# Altium project NODE_V2.PrjPcb
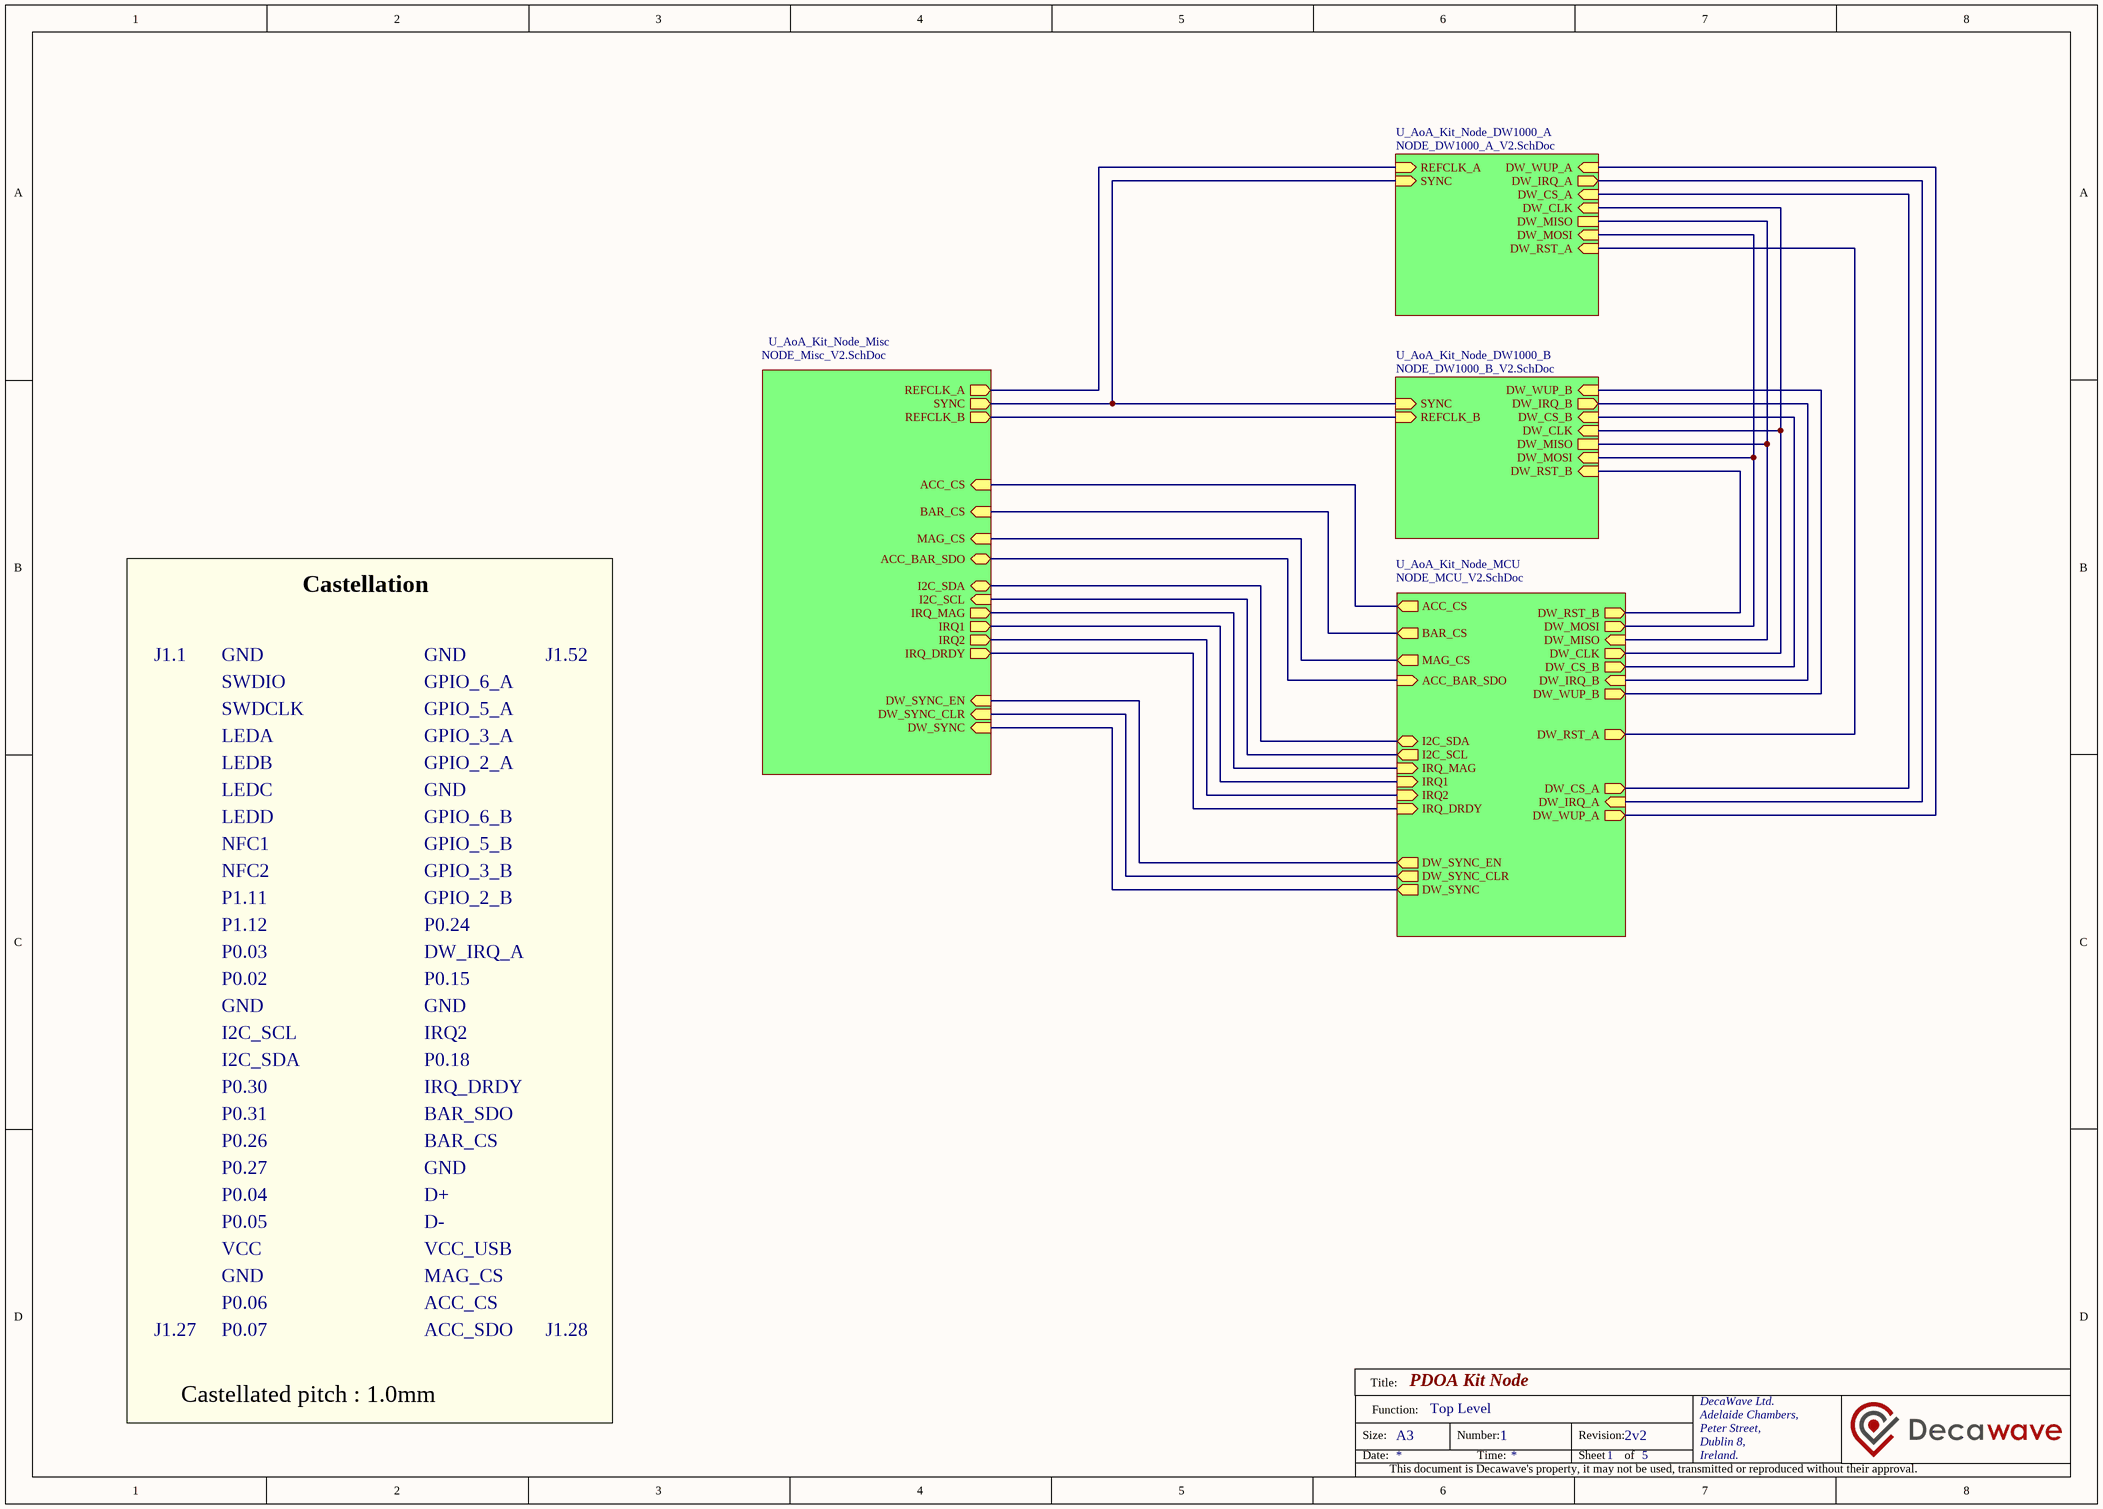
[diagram p0: NODE_Top_V2.SchDoc]
5 sheets, 231 parts. Net scope: hierarchical (ports join the sheet entries above them; power ports are global).
Board file: NODE_V2.PcbDoc
Sheets:
  NODE_Top_V2.SchDoc
    U_AoA_Kit_Node_Misc = NODE_Misc_V2.SchDoc
    U_AoA_Kit_Node_MCU = NODE_MCU_V2.SchDoc
    U_AoA_Kit_Node_DW1000_A = NODE_DW1000_A_V2.SchDoc
    U_AoA_Kit_Node_DW1000_B = NODE_DW1000_B_V2.SchDoc

## Sheet NODE_Top_V2.SchDoc: PDOA Kit Node
size A3; Organization: Decawave Ltd.; Address1: Adelaide Chambers,; Address2: Peter Street,; Address3: Dublin 8,; Address4: Ireland.; DocumentNumber: 1; Revision: 2v2; SheetNumber: 1; SheetTotal: 5; SheetFunction: Top Level; ProjectName: PDOA Kit Node

### Sub-sheets
U_AoA_Kit_Node_DW1000_A = NODE_DW1000_A_V2.SchDoc: DW_MOSI (in), DW_IRQ_A (out), DW_CS_A (in), DW_WUP_A (in), DW_MISO, DW_CLK (in), REFCLK_A (in), SYNC (in), DW_RST_A (in)
U_AoA_Kit_Node_DW1000_B = NODE_DW1000_B_V2.SchDoc: DW_MOSI (in), DW_IRQ_B (out), DW_CS_B (in), DW_WUP_B (in), DW_MISO, DW_CLK (in), REFCLK_B (in), SYNC (in), DW_RST_B (in)
U_AoA_Kit_Node_MCU = NODE_MCU_V2.SchDoc: DW_IRQ_A (in), DW_CS_A (out), DW_CS_B (out), DW_SYNC_EN (out), DW_SYNC_CLR (out), DW_SYNC (out), DW_MISO (in), DW_RST_A (out), DW_MOSI (out), DW_CLK (out), I2C_SDA (bidir), I2C_SCL (out), IRQ_MAG (in), IRQ1 (in), IRQ2 (in), IRQ_DRDY (in), DW_WUP_B (out), DW_IRQ_B (in), DW_RST_B (out), DW_WUP_A (out), ACC_CS (out), BAR_CS (out), MAG_CS (out), ACC_BAR_SDO (in)
U_AoA_Kit_Node_Misc = NODE_Misc_V2.SchDoc: REFCLK_B (out), REFCLK_A (out), SYNC (out), DW_SYNC_EN (in), DW_SYNC (in), DW_SYNC_CLR (in), I2C_SCL (in), I2C_SDA (bidir), IRQ_MAG (out), IRQ1 (out), IRQ2 (out), IRQ_DRDY (out), ACC_CS (in), BAR_CS (in), MAG_CS (in), ACC_BAR_SDO (bidir)

### Nets
ACC_BAR_SDO: sheet U_AoA_Kit_Node_Misc/ACC_BAR_SDO, sheet U_AoA_Kit_Node_MCU/ACC_BAR_SDO
ACC_CS: sheet U_AoA_Kit_Node_Misc/ACC_CS, sheet U_AoA_Kit_Node_MCU/ACC_CS
BAR_CS: sheet U_AoA_Kit_Node_Misc/BAR_CS, sheet U_AoA_Kit_Node_MCU/BAR_CS
DW_CLK: sheet U_AoA_Kit_Node_MCU/DW_CLK, sheet U_AoA_Kit_Node_DW1000_A/DW_CLK, sheet U_AoA_Kit_Node_DW1000_B/DW_CLK
DW_CS_A: sheet U_AoA_Kit_Node_MCU/DW_CS_A, sheet U_AoA_Kit_Node_DW1000_A/DW_CS_A
DW_CS_B: sheet U_AoA_Kit_Node_MCU/DW_CS_B, sheet U_AoA_Kit_Node_DW1000_B/DW_CS_B
DW_IRQ_A: sheet U_AoA_Kit_Node_MCU/DW_IRQ_A, sheet U_AoA_Kit_Node_DW1000_A/DW_IRQ_A
DW_IRQ_B: sheet U_AoA_Kit_Node_MCU/DW_IRQ_B, sheet U_AoA_Kit_Node_DW1000_B/DW_IRQ_B
DW_MISO: sheet U_AoA_Kit_Node_MCU/DW_MISO, sheet U_AoA_Kit_Node_DW1000_A/DW_MISO, sheet U_AoA_Kit_Node_DW1000_B/DW_MISO
DW_MOSI: sheet U_AoA_Kit_Node_MCU/DW_MOSI, sheet U_AoA_Kit_Node_DW1000_A/DW_MOSI, sheet U_AoA_Kit_Node_DW1000_B/DW_MOSI
DW_RST_A: sheet U_AoA_Kit_Node_MCU/DW_RST_A, sheet U_AoA_Kit_Node_DW1000_A/DW_RST_A
DW_RST_B: sheet U_AoA_Kit_Node_MCU/DW_RST_B, sheet U_AoA_Kit_Node_DW1000_B/DW_RST_B
DW_SYNC: sheet U_AoA_Kit_Node_Misc/DW_SYNC, sheet U_AoA_Kit_Node_MCU/DW_SYNC
DW_SYNC_CLR: sheet U_AoA_Kit_Node_Misc/DW_SYNC_CLR, sheet U_AoA_Kit_Node_MCU/DW_SYNC_CLR
DW_SYNC_EN: sheet U_AoA_Kit_Node_Misc/DW_SYNC_EN, sheet U_AoA_Kit_Node_MCU/DW_SYNC_EN
DW_WUP_A: sheet U_AoA_Kit_Node_MCU/DW_WUP_A, sheet U_AoA_Kit_Node_DW1000_A/DW_WUP_A
DW_WUP_B: sheet U_AoA_Kit_Node_MCU/DW_WUP_B, sheet U_AoA_Kit_Node_DW1000_B/DW_WUP_B
I2C_SCL: sheet U_AoA_Kit_Node_Misc/I2C_SCL, sheet U_AoA_Kit_Node_MCU/I2C_SCL
I2C_SDA: sheet U_AoA_Kit_Node_Misc/I2C_SDA, sheet U_AoA_Kit_Node_MCU/I2C_SDA
IRQ1: sheet U_AoA_Kit_Node_Misc/IRQ1, sheet U_AoA_Kit_Node_MCU/IRQ1
IRQ2: sheet U_AoA_Kit_Node_Misc/IRQ2, sheet U_AoA_Kit_Node_MCU/IRQ2
IRQ_DRDY: sheet U_AoA_Kit_Node_Misc/IRQ_DRDY, sheet U_AoA_Kit_Node_MCU/IRQ_DRDY
IRQ_MAG: sheet U_AoA_Kit_Node_Misc/IRQ_MAG, sheet U_AoA_Kit_Node_MCU/IRQ_MAG
MAG_CS: sheet U_AoA_Kit_Node_Misc/MAG_CS, sheet U_AoA_Kit_Node_MCU/MAG_CS
REFCLK_A: sheet U_AoA_Kit_Node_Misc/REFCLK_A, sheet U_AoA_Kit_Node_DW1000_A/REFCLK_A
REFCLK_B: sheet U_AoA_Kit_Node_Misc/REFCLK_B, sheet U_AoA_Kit_Node_DW1000_B/REFCLK_B
SYNC: sheet U_AoA_Kit_Node_Misc/SYNC, sheet U_AoA_Kit_Node_DW1000_A/SYNC, sheet U_AoA_Kit_Node_DW1000_B/SYNC

### Notes on the sheet
- Sheet 2
- Castellation
- J1.1
- GND
- SWDIO
- SWDCLK
- GPIO_5_A
- GPIO_6_A
- J1.52
- LEDA
- LEDB
- GPIO_2_A
- GPIO_3_A
- LEDC
- LEDD
- NFC1
- GPIO_5_B
- GPIO_6_B
- NFC2
- P1.11
- GPIO_2_B
- GPIO_3_B
- P1.12
- P0.03
- P0.02
- P0.15
- DW_IRQ_A
- P0.24
- I2C_SCL
- IRQ2
- I2C_SDA
- P0.30
- P0.31
- BAR_SDO
- IRQ_DRDY
- P0.18
- P0.26
- P0.27
- BAR_CS
- P0.04
- P0.05
- VCC
- VCC_USB
- D-
- D+
- P0.06
- ACC_CS
- MAG_CS
- J1.27
- P0.07
- ACC_SDO
- J1.28
- Castellated pitch : 1.0mm
- Title:
- Size:
- Date:
- Function:
- A3
- Number:
- Time:
- Revision:
- Sheet
- of
- DecaWave Ltd.
- Adelaide Chambers,
- Peter Street,
- Dublin 8,
- Ireland.
- This document is Decawave's property, it may not be used, transmitted or reproduced without their approval.

## Sheet NODE_Misc_V2.SchDoc: PDOA Kit Node
size A3; Organization: Decawave Ltd.; Address1: Adelaide Chambers,; Address2: Peter Street,; Address3: Dublin 8,; Address4: Ireland.; DocumentNumber: 5; Revision: 2v2; SheetNumber: 5; SheetTotal: 5; SheetFunction: Miscellaneous; ProjectName: PDOA Kit Node
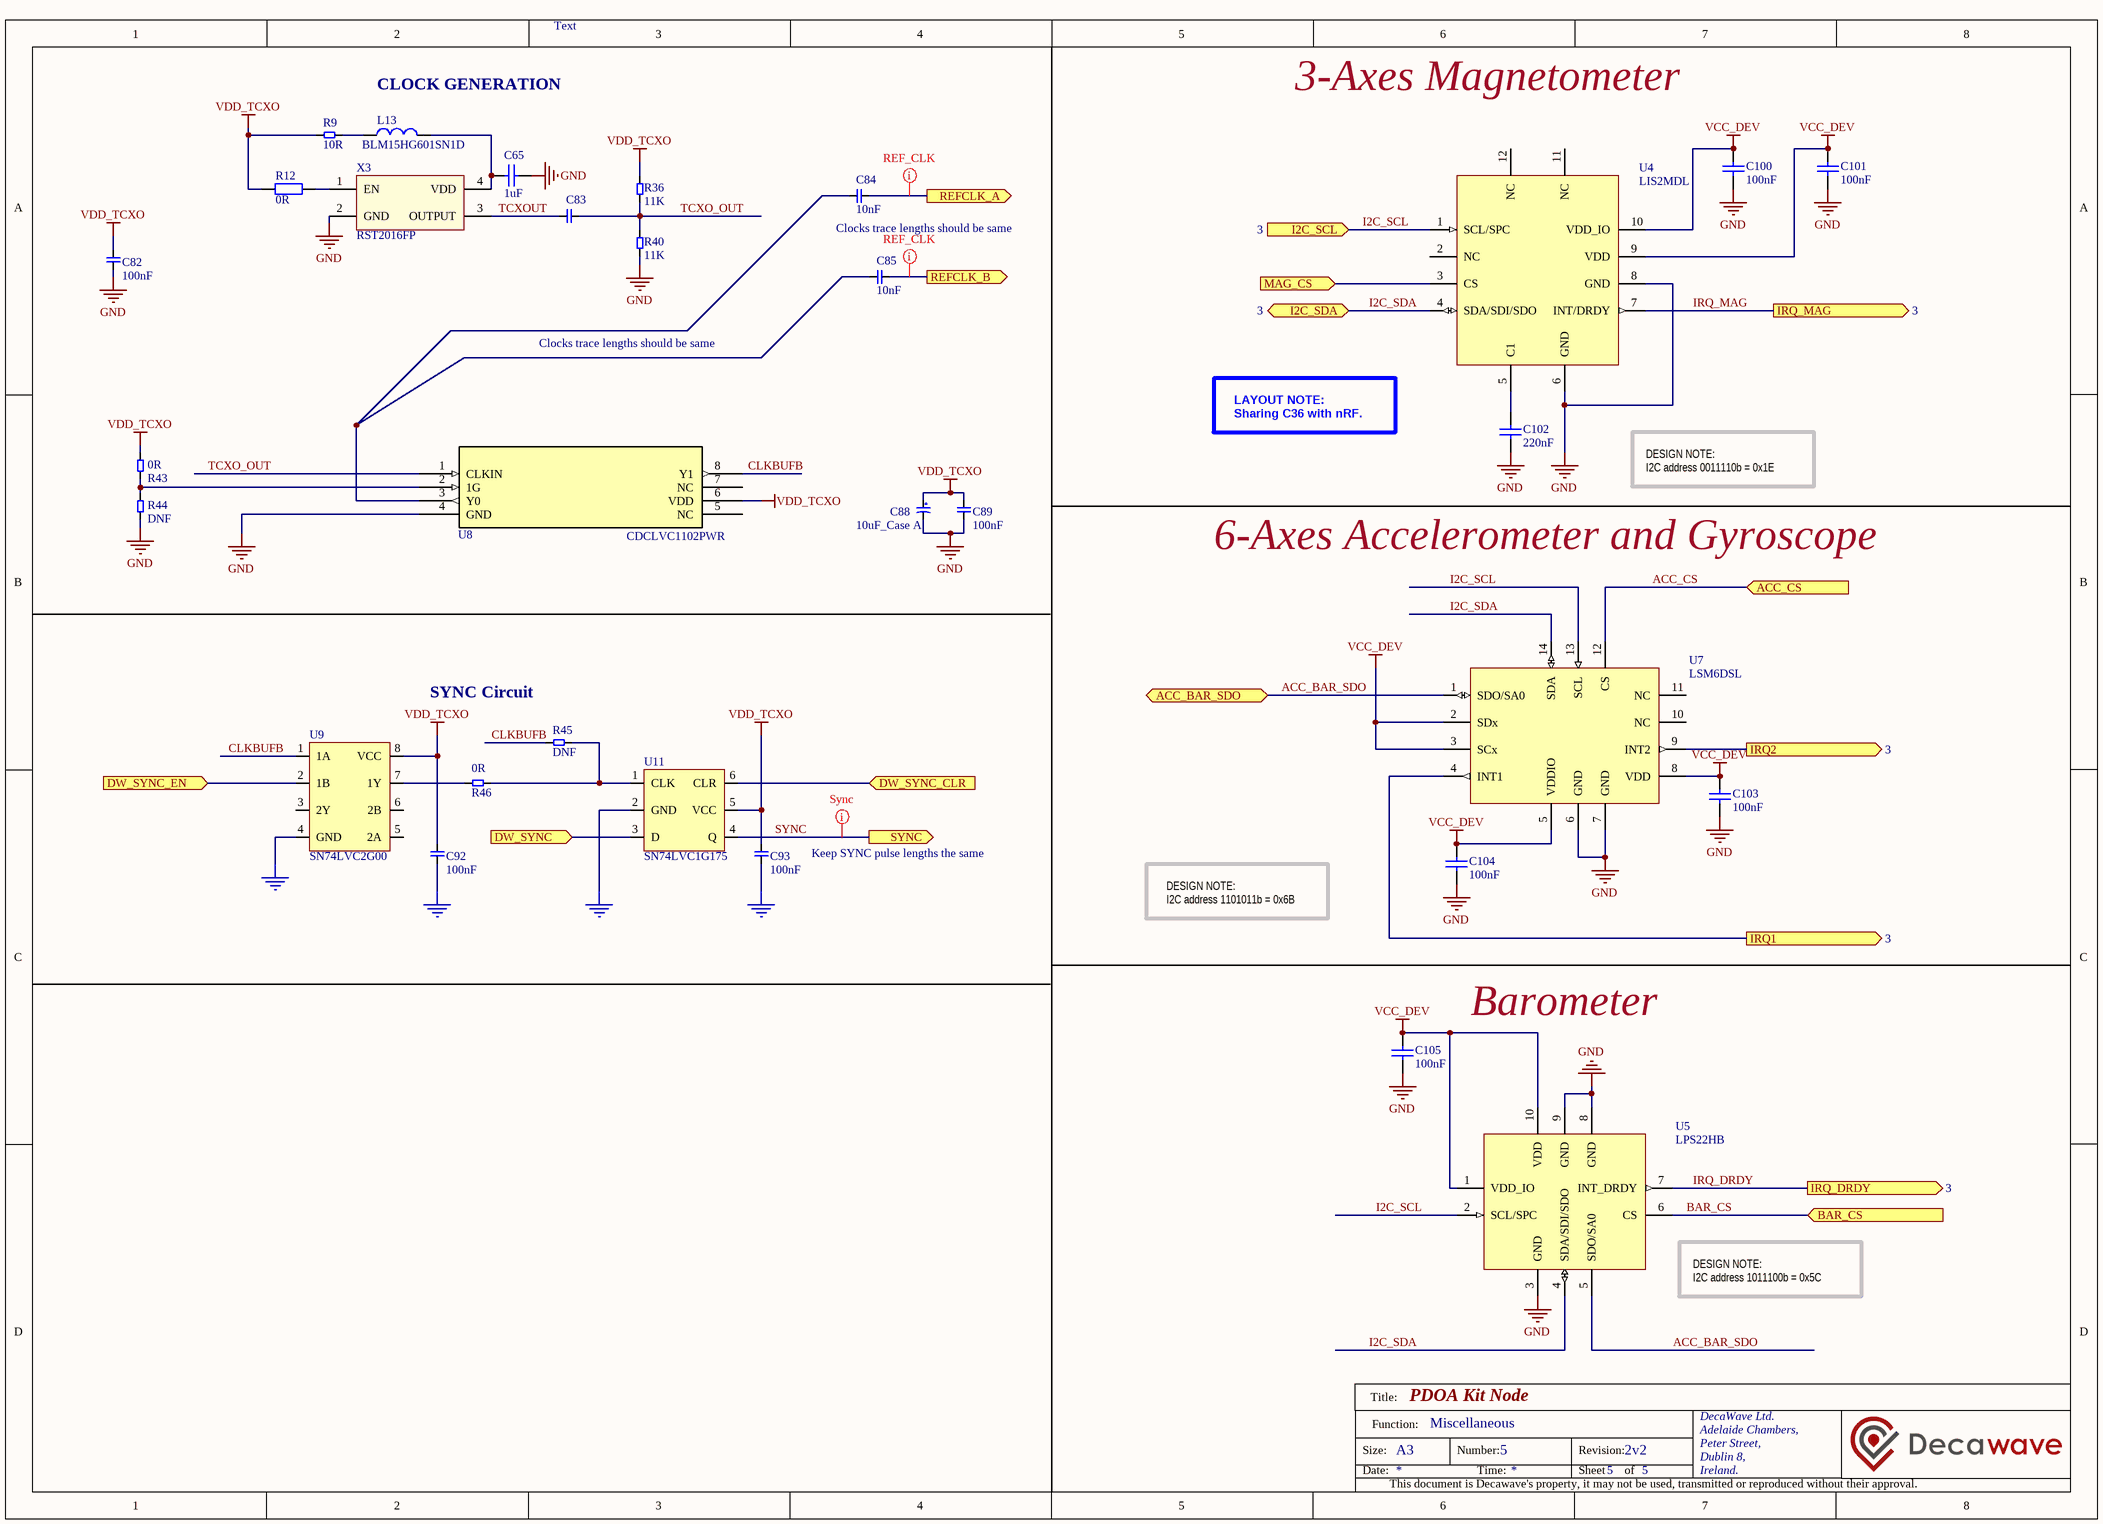
[diagram p1: NODE_Misc_V2.SchDoc]

### Parts
C65  1uF  [C0402]
C82  100nF  [C0201]
C83  1nF  [C0402]  (value not drawn)
C84  10nF  [C0201]
C85  10nF  [C0201]
C88  10uF_Case A  [TANT3216]
C89  100nF  [C0201]
C92  100nF  [C0201]
C93  100nF  [C0201]
C100  100nF  [C0201]
C101  100nF  [C0201]
C102  220nF  [C0201]
C103  100nF  [C0201]
C104  100nF  [C0201]
C105  100nF  [C0201]
L13  BLM15HG601SN1D  [L0402]
R9  10R  [R0201]
R12  0R  [R0201]
R36  11K  [R0201]
R40  11K  [R0201]
R43  0R  [R0201]
R44  DNF  [R0201]
R45  DNF  [R0201]
R46  0R  [R0201]
U4  LIS2MDL  [IC_LGA-12]
U5  LPS22HB  [HLGA-10L]
U7  LSM6DSL  [IC_LGA-14]
U8  Manufacturer Part Number: CDCLVC1102PWR  [TSSOP8_0P65_4P5X3P4]  (hidden comment: CDCLVC1102)
U9  SN74LVC2G00  [VSSOP8_0P5_2P1X2P4]
U11  SN74LVC1G175  [SC70-6_0P65_2P15X1P4]
X3  RST2016FP  [CAT567]

### Ports
ACC_BAR_SDO (bidir), ACC_CS (in), BAR_CS (in), DW_SYNC (in), DW_SYNC_CLR (in), DW_SYNC_EN (in), I2C_SCL (in, see 3), I2C_SDA (bidir, see 3), IRQ1 (out, see 3), IRQ2 (out, see 3), IRQ_DRDY (out, see 3), IRQ_MAG (out, see 3), MAG_CS (in), REFCLK_A (out), REFCLK_B (out), SYNC (out)

### Nets
GND: C65.1 C82.1 C88.2 C89.1 C92.1 C93.1 C100.1 C101.1 C102.1 C103.1 C104.1 C105.1 R40.1 R44.1 U4.6(GND) U4.8(GND) U5.3(GND) U5.8(GND) U5.9(GND) U7.6(GND) U7.7(GND) U8.4(GND) U9.4(GND) U11.2(GND) X3.2(GND)
VCC_DEV: C100.2 C101.2 C103.2 C104.2 C105.2 U4.9(VDD) U4.10(VDD_IO) U5.1(VDD_IO) U5.10(VDD) U7.2(SDx) U7.3(SCx) U7.5(VDDIO) U7.8(VDD)
VDD_TCXO: C82.2 C88.1 C89.2 C92.2 C93.2 R9.2 R12.1 R36.2 R43.1 U8.6(VDD) U9.8(VCC) U11.5(VCC)
ACC_BAR_SDO: U5.5(SDO/SA0) U7.1(SDO/SA0) ; port ACC_BAR_SDO
ACC_CS: U7.12(CS) ; port ACC_CS
BAR_CS: U5.6(CS) ; port BAR_CS
CLKBUFB: R45.2 U8.8(Y1) U9.1(1A)
DW_SYNC: U11.3(D) ; port DW_SYNC
DW_SYNC_CLR: U11.6(CLR) ; port DW_SYNC_CLR
DW_SYNC_EN: U9.2(1B) ; port DW_SYNC_EN
I2C_SCL: U4.1(SCL/SPC) U5.2(SCL/SPC) U7.13(SCL) ; port I2C_SCL
I2C_SDA: U4.4(SDA/SDI/SDO) U5.4(SDA/SDI/SDO) U7.14(SDA) ; port I2C_SDA
IRQ1: U7.4(INT1) ; port IRQ1
IRQ2: U7.9(INT2) ; port IRQ2
IRQ_DRDY: U5.7(INT_DRDY) ; port IRQ_DRDY
IRQ_MAG: U4.7(INT/DRDY) ; port IRQ_MAG
MAG_CS: U4.3(CS) ; port MAG_CS
REFCLK_A: C84.1 ; port REFCLK_A
REFCLK_B: C85.1 ; port REFCLK_B
SYNC: U11.4(Q) ; port SYNC
TCXO_OUT: C83.2 R36.1 R40.2 U8.1(CLKIN)
TCXOUT: C83.1 X3.3(OUTPUT)
NetC65_2: C65.2 L13.2 X3.4(VDD)
NetC84_2: C84.2 C85.2 U8.3(Y0)
NetC102_2: C102.2 U4.5(C1)
NetL13_1: L13.1 R9.1
NetR12_2: R12.2 X3.1(EN)
NetR43_2: R43.2 R44.2 U8.2(1G)
NetR45_1: R45.1 R46.1 U11.1(CLK)
NetR46_2: R46.2 U9.7(1Y)

Not connected (* = marked no-connect by the designer): U4 2(NC) 11(NC) 12(NC); U7 10(NC) 11(NC); U8 5(NC) 7(NC); U9 3(2Y) 5(2A) 6(2B)

### Layout directives
net class REF_CLK: REFCLK_A, REFCLK_B
net class Sync: SYNC

### Notes on the sheet
- Text
- CLOCK GENERATION
- 3-Axes Magnetometer
- Clocks trace lengths should be same
- (near U4) LAYOUT NOTE:
  Sharing C36 with nRF.
- DESIGN NOTE:
  I2C address 0011110b = 0x1E
- 6-Axes Accelerometer and Gyroscope
- SYNC Circuit
- (near C93) Keep SYNC pulse lengths the same
- DESIGN NOTE:
  I2C address 1101011b = 0x6B
- Barometer
- (near U5) DESIGN NOTE:
  I2C address 1011100b = 0x5C
- Title:
- Size:
- Date:
- Function:
- A3
- Number:
- Time:
- Revision:
- Sheet
- of
- DecaWave Ltd.
- Adelaide Chambers,
- Peter Street,
- Dublin 8,
- Ireland.
- This document is Decawave's property, it may not be used, transmitted or reproduced without their approval.

### Library data of the parts
C65 = GRM155R61A105KE15D: CAP CER 1UF 10V X5R 0402; Manufacturer: Murata Electronics North America; Manufacturer Part Number: GRM155R61A105KE15D
C82 C89 C92 C93 = C10051: 100nF_0201_10%; Manufacturer: Murata Electronics North America; Manufacturer Part Number: GRM033C81E104KE14D
C83 = C10011: 1nF_0402_10%; Manufacturer Part Number: GRM155R71H102KA01D; Manufacturer: Murata Electronics North America
C84 C85 = C10062: 10nF_0201_10%; Manufacturer: Murata Electronics North America; Manufacturer Part Number: GRM033R61E103KA12D
C88 = C10001: 10uF_CaseA_10%; Manufacturer Part Number: 293D106X9016A2TE3; Manufacturer: Vishay
C100 C101 C103-C105 = GRM033C81E104ME14D: 100nF_0201_10%; Manufacturer: Murata Electronics North America; Manufacturer Part Number: GRM033C81E104KE14D
C102 = GRM033C81E104ME14D: CAP CER 220nF 25V X6S 0201; Manufacturer: Murata Electronics North America; Manufacturer Part Number: GRM033R61A224KE90D
L13 = M10012: FERRITE BEAD, 0.7OHM, 300MA, 0402; Manufacturer: Murata Electronics North America; Manufacturer Part Number: BLM15HG601SN1D
R9 = R10056: 10R_0201_1%; Manufacturer Part Number: RC0201FR-0710RL; Manufacturer: Yageo
R12 = RC0201JR-070RL: RES SMD 0.0OHM JUMPER 1/20W 0201; Manufacturer: Yageo; Manufacturer Part Number: RC0201JR-070RL
R36 R40 = R10051: 11K_0201_1%; Manufacturer: Yageo; Manufacturer Part Number: RC0201FR-0711KL
R43 R46 = R10056: RES SMD 0.0OHM JUMPER 1/20W 0201; Manufacturer Part Number: RC0201JR-070RL; Manufacturer: Yageo
R44 R45 = R10048
U4 = LIS2MDL: Manufacturer: STmicroelectronics; Manufacturer Part Number: LIS2MDLTR
U5 = LPS22HB: Manufacturer: STmicroelectronics; Manufacturer Part Number: LPS22HBTR
U7 = LSM6DSL: Manufacturer: STmicroelectronics; Manufacturer Part Number: LSM6DSLTR
U8 = U10016: Low Jitter,1:2 LVCMOS Fan-out Clock Buffer; Manufacturer: TI
U9 = U10017: 2 Input NAND; Manufacturer Part Number: SN74LVC2G00DCU; Manufacturer: TI
U11 = U10018: Single D-Type Flip Flop with Async Clear; Manufacturer Part Number: SN74LVC1G175DCK; Manufacturer: TI
X3 = RST2016FP: CRYSTAL TXCO RST2016FP; Manufacturer: Rakon; Manufacturer Part Number: RST2016FP

## Sheet NODE_MCU_V2.SchDoc: PDOA Kit Node
size A3; Organization: Decawave Ltd.; Address1: Adelaide Chambers,; Address2: Peter Street,; Address3: Dublin 8,; Address4: Ireland.; DocumentNumber: 2; Revision: 2v2; SheetNumber: 2; SheetTotal: 5; SheetFunction: MCU; ProjectName: PDOA Kit Node
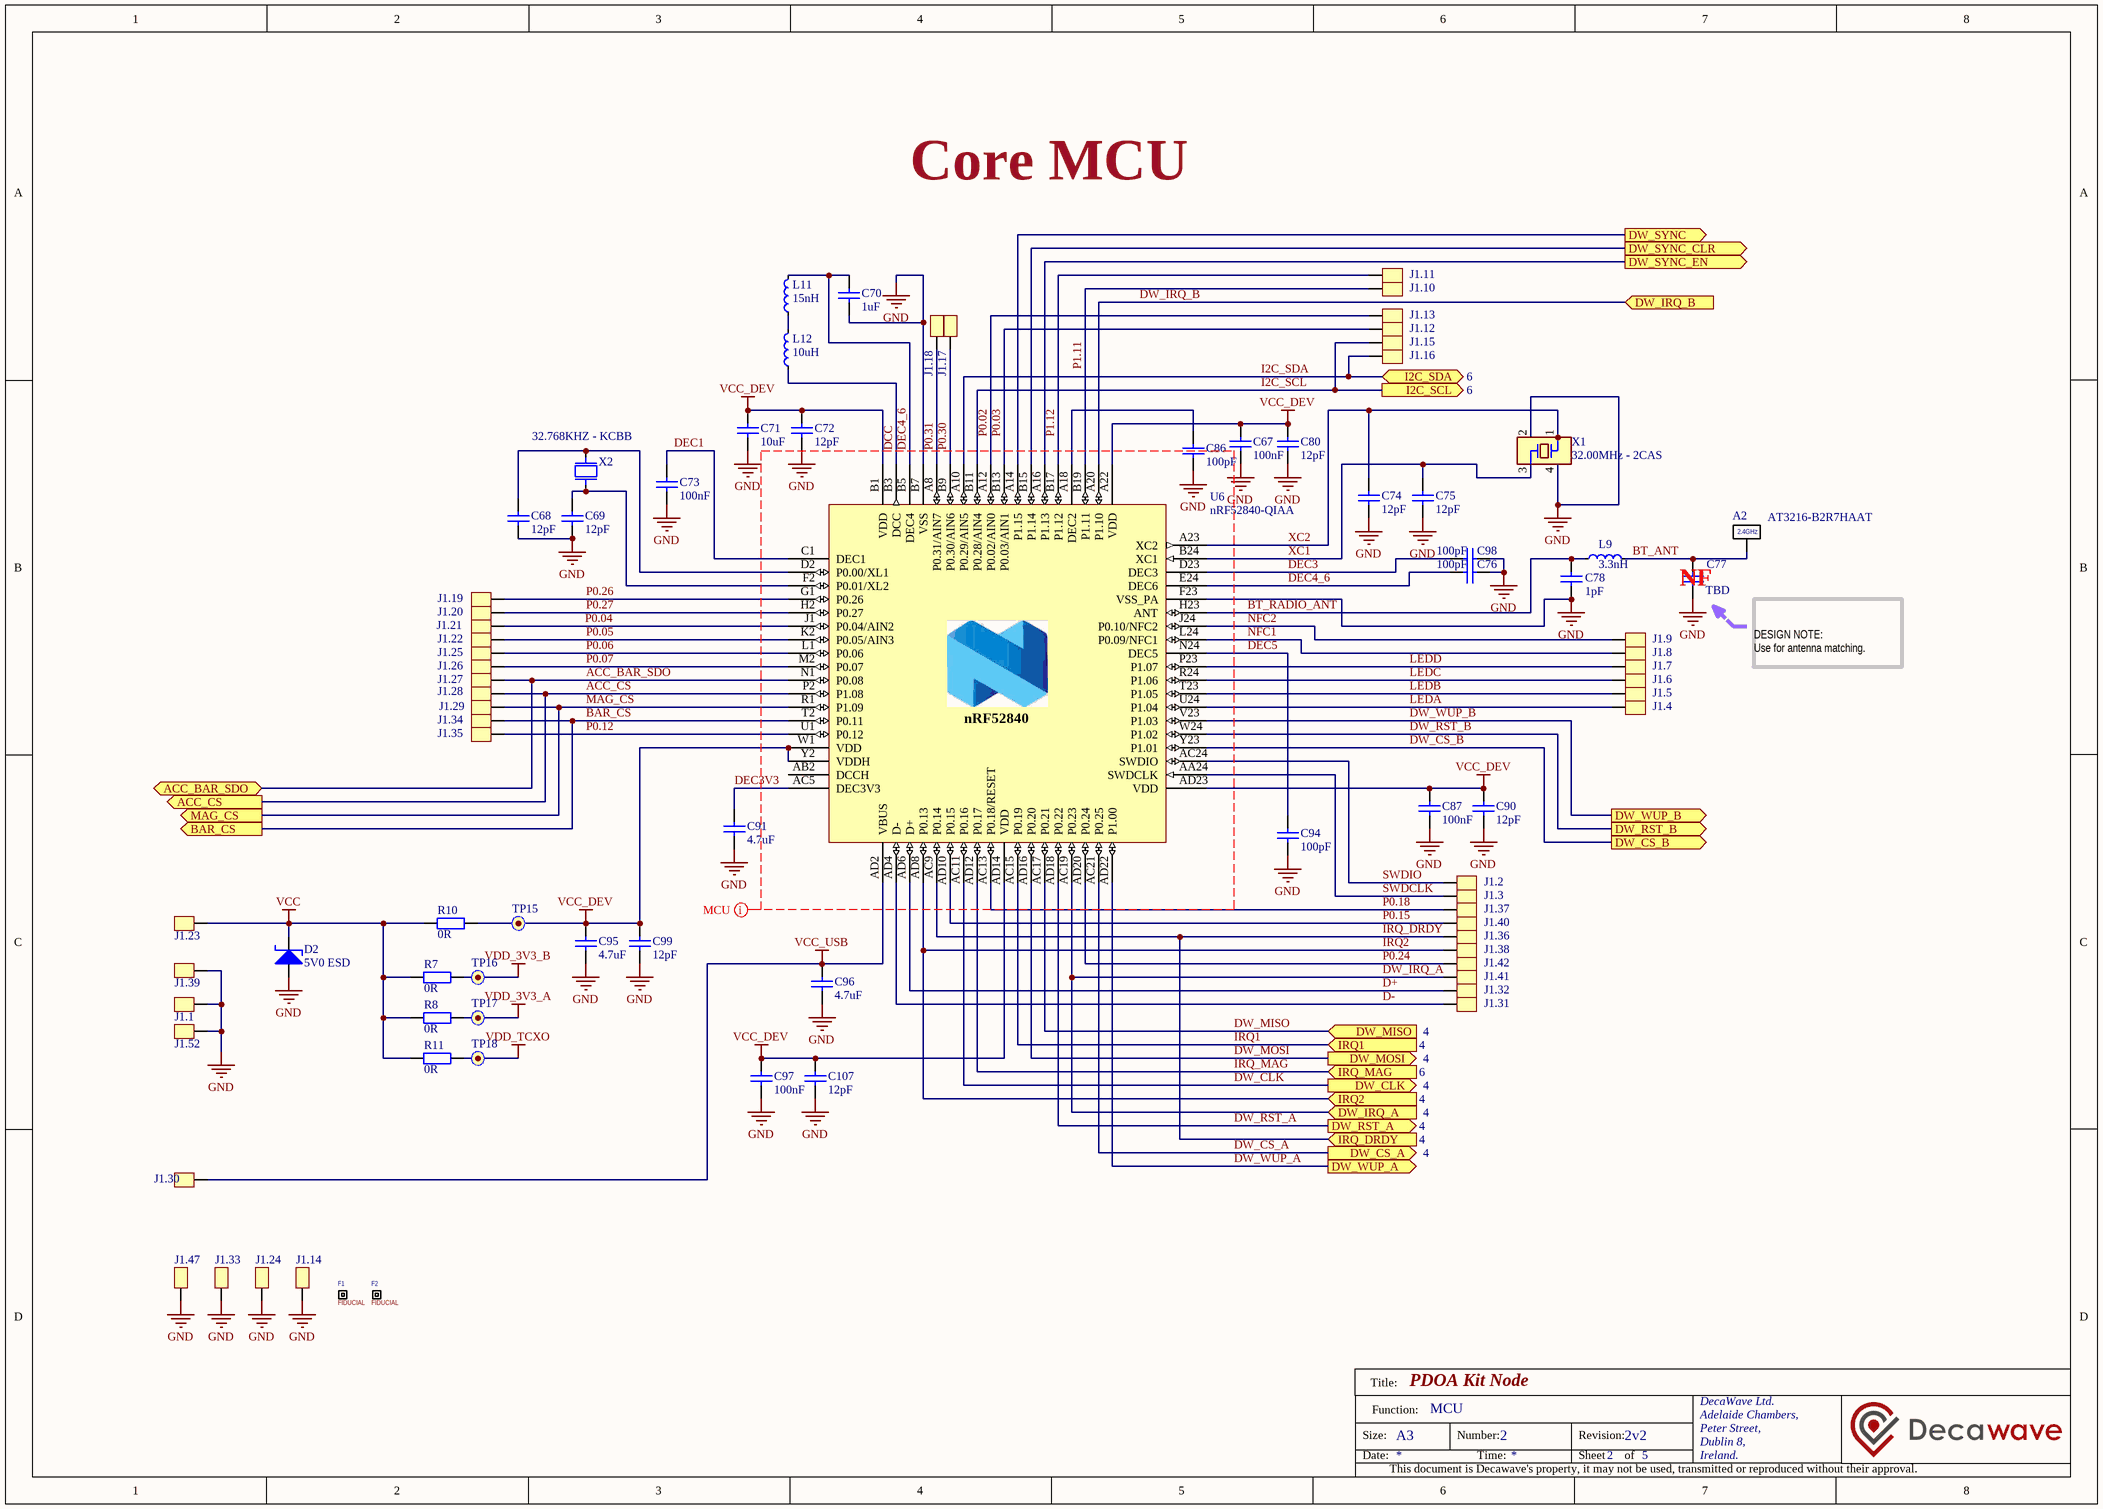
[diagram p2: NODE_MCU_V2.SchDoc]

### Parts
A2  AT3216-B2R7HAAT  [AT3216]
C67  100nF  [C0201]
C68  12pF  [C0201]
C69  12pF  [C0201]
C70  1uF  [C0402]
C71  10uF  [C0603]
C72  12pF  [C0201]
C73  100nF  [C0201]
C74  12pF  [C0201]
C75  12pF  [C0201]
C76  100pF  [C0201]
C77  TBD  [C0201]
C78  1pF  [C0201]
C80  12pF  [C0201]
C86  100pF  [C0201]
C87  100nF  [C0201]
C90  12pF  [C0201]
C91  4.7uF  [C0603]
C94  100pF  [C0201]
C95  4.7uF  [C0603]
C96  4.7uF  [C0603]
C97  100nF  [C0201]
C98  100pF  [C0201]
C99  12pF  [C0201]
C107  12pF  [C0201]
D2  5V0 ESD  [DFN65P100X40-2N]
F1  FIDUCIAL  [FID1]
F2  FIDUCIAL  [FID1]
J1.1  EDGE_PIN  [PCB_EDGE_1MM]  (value not drawn)  (no BOM)
J1.2  EDGE_PIN  [PCB_EDGE_1MM]  (value not drawn)
J1.3  EDGE_PIN  [PCB_EDGE_1MM]  (value not drawn)
J1.4  EDGE_PIN  [PCB_EDGE_1MM]  (value not drawn)
J1.5  EDGE_PIN  [PCB_EDGE_1MM]  (value not drawn)
J1.6  EDGE_PIN  [PCB_EDGE_1MM]  (value not drawn)
J1.7  EDGE_PIN  [PCB_EDGE_1MM]  (value not drawn)
J1.8  EDGE_PIN  [PCB_EDGE_1MM]  (value not drawn)
J1.9  EDGE_PIN  [PCB_EDGE_1MM]  (value not drawn)
J1.10  EDGE_PIN  [PCB_EDGE_1MM]  (value not drawn)
J1.11  EDGE_PIN  [PCB_EDGE_1MM]  (value not drawn)
J1.12  EDGE_PIN  [PCB_EDGE_1MM]  (value not drawn)
J1.13  EDGE_PIN  [PCB_EDGE_1MM]  (value not drawn)
J1.14  EDGE_PIN  [PCB_EDGE_1MM]  (value not drawn)
J1.15  EDGE_PIN  [PCB_EDGE_1MM]  (value not drawn)
J1.16  EDGE_PIN  [PCB_EDGE_1MM]  (value not drawn)
J1.17  EDGE_PIN  [PCB_EDGE_1MM]  (value not drawn)
J1.18  EDGE_PIN  [PCB_EDGE_1MM]  (value not drawn)
J1.19  EDGE_PIN  [PCB_EDGE_1MM]  (value not drawn)  (no BOM)
J1.20  EDGE_PIN  [PCB_EDGE_1MM]  (value not drawn)
J1.21  EDGE_PIN  [PCB_EDGE_1MM]  (value not drawn)
J1.22  EDGE_PIN  [PCB_EDGE_1MM]  (value not drawn)  (no BOM)
J1.23  EDGE_PIN  [PCB_EDGE_1MM]  (value not drawn)  (no BOM)
J1.24  EDGE_PIN  [PCB_EDGE_1MM]  (value not drawn)
J1.25  EDGE_PIN  [PCB_EDGE_1MM]  (value not drawn)
J1.26  EDGE_PIN  [PCB_EDGE_1MM]  (value not drawn)
J1.27  EDGE_PIN  [PCB_EDGE_1MM]  (value not drawn)
J1.28  EDGE_PIN  [PCB_EDGE_1MM]  (value not drawn)
J1.29  EDGE_PIN  [PCB_EDGE_1MM]  (value not drawn)
J1.30  EDGE_PIN  [PCB_EDGE_1MM]  (value not drawn)  (no BOM)
J1.31  EDGE_PIN  [PCB_EDGE_1MM]  (value not drawn)
J1.32  EDGE_PIN  [PCB_EDGE_1MM]  (value not drawn)
J1.33  EDGE_PIN  [PCB_EDGE_1MM]  (value not drawn)
J1.34  EDGE_PIN  [PCB_EDGE_1MM]  (value not drawn)
J1.35  EDGE_PIN  [PCB_EDGE_1MM]  (value not drawn)  (no BOM)
J1.36  EDGE_PIN  [PCB_EDGE_1MM]  (value not drawn)
J1.37  EDGE_PIN  [PCB_EDGE_1MM]  (value not drawn)
J1.38  EDGE_PIN  [PCB_EDGE_1MM]  (value not drawn)
J1.39  EDGE_PIN  [PCB_EDGE_1MM]  (value not drawn)  (no BOM)
J1.40  EDGE_PIN  [PCB_EDGE_1MM]  (value not drawn)
J1.41  EDGE_PIN  [PCB_EDGE_1MM]  (value not drawn)
J1.42  EDGE_PIN  [PCB_EDGE_1MM]  (value not drawn)
J1.47  EDGE_PIN  [PCB_EDGE_1MM]  (value not drawn)
J1.52  EDGE_PIN  [PCB_EDGE_1MM]  (value not drawn)  (no BOM)
L9  3.3nH  [L0201]
L11  15nH  [INDC1005X05N]
L12  10uH  [L0603]
R7  0R  [R0201]
R8  0R  [R0402 -RF]
R10  0R  [R0201]
R11  0R  [R0201]
TP15  TP  [TP_40S]  (value not drawn)
TP16  TP  [TP_40S]  (value not drawn)
TP17  TP  [TP_40S]  (value not drawn)
TP18  TP  [TP_40S]  (value not drawn)
U6  nRF52840-QIAA  [AQFN50P700X700X85_HS-74N]
X1  32.00MHz - 2CAS  [ABM10]
X2  32.768KHZ - KCBB  [XTAL_SMD_3.2X1.5MM]

### Ports
ACC_BAR_SDO (bidir), ACC_CS (out), BAR_CS (out), DW_CLK (out, see 4), DW_CS_A (out, see 4), DW_CS_B (out), DW_IRQ_A (in, see 4), DW_IRQ_B (in), DW_MISO (in, see 4), DW_MOSI (out, see 4), DW_RST_A (out, see 4), DW_RST_B (out), DW_SYNC (out), DW_SYNC_CLR (out), DW_SYNC_EN (out), DW_WUP_A (out), DW_WUP_B (out), I2C_SCL (out, see 6), I2C_SDA (bidir, see 6), IRQ1 (in, see 4), IRQ2 (in, see 4), IRQ_DRDY (in, see 4), IRQ_MAG (in, see 6), MAG_CS (out)

### Nets
GND: C67.1 C68.1 C69.1 C70.1 C71.1 C72.1 C73.1 C74.1 C75.1 C76.1 C77.1 C78.1 C80.1 C86.1 C87.1 C90.1 C91.1 C94.1 C95.1 C96.1 C97.1 C98.1 C99.1 C107.1 D2.A J1.1.0 J1.14.0 J1.24.0 J1.33.0 J1.39.0 J1.47.0 J1.52.0 U6.74(GND) U6.B7(VSS) U6.F23(VSS_PA) X1.2 X1.4
VCC: D2.K J1.23.0 R7.1 R8.1 R10.1 R11.1
VCC_DEV: C67.2 C71.2 C72.2 C80.2 C87.2 C90.2 C95.2 C97.2 C99.2 C107.2 R10.2 TP15.1 U6.A22(VDD) U6.AD14(VDD) U6.AD23(VDD) U6.B1(VDD) U6.W1(VDD) U6.Y2(VDDH)
VCC_USB: C96.2 J1.30.0 U6.AD2(VBUS)
VDD_3V3_A: R8.2 TP17.1
VDD_3V3_B: R7.2 TP16.1
VDD_TCXO: R11.2 TP18.1
ACC_BAR_SDO: J1.27.0 U6.N1(P0.08) ; port ACC_BAR_SDO
ACC_CS: J1.28.0 U6.P2(P1.08) ; port ACC_CS
BAR_CS: J1.34.0 U6.T2(P0.11) ; port BAR_CS
BT_ANT: A2.1 C77.2 L9.2
BT_RADIO_ANT: C78.2 L9.1 U6.H23(ANT)
D+: J1.32.0 U6.AD6(D+)
D-: J1.31.0 U6.AD4(D-)
DCC: L12.1 U6.B3(DCC)
DEC1: C73.2 U6.C1(DEC1)
DEC3: C98.2 U6.D23(DEC3)
DEC3V3: C91.2 U6.AC5(DEC3V3)
DEC4_6: C70.2 C76.2 L11.2 U6.B5(DEC4) U6.E24(DEC6)
DEC5: C94.2 U6.N24(DEC5)
DW_CLK: U6.AC11(P0.16) ; port DW_CLK
DW_CS_A: U6.AC21(P0.25) ; port DW_CS_A
DW_CS_B: U6.Y23(P1.01) ; port DW_CS_B
DW_IRQ_A: J1.41.0 U6.AC19(P0.23) ; port DW_IRQ_A
DW_IRQ_B: U6.A20(P1.10) ; port DW_IRQ_B
DW_MISO: U6.AC17(P0.21) ; port DW_MISO
DW_MOSI: U6.AD16(P0.20) ; port DW_MOSI
DW_RST_A: U6.AD18(P0.22) ; port DW_RST_A
DW_RST_B: U6.W24(P1.02) ; port DW_RST_B
DW_SYNC: U6.A14(P1.15) ; port DW_SYNC
DW_SYNC_CLR: U6.B15(P1.14) ; port DW_SYNC_CLR
DW_SYNC_EN: U6.A16(P1.13) ; port DW_SYNC_EN
DW_WUP_A: U6.AD22(P1.00) ; port DW_WUP_A
DW_WUP_B: U6.V23(P1.03) ; port DW_WUP_B
I2C_SCL: J1.15.0 U6.B11(P0.28/AIN4) ; port I2C_SCL
I2C_SDA: J1.16.0 U6.A10(P0.29/AIN5) ; port I2C_SDA
IRQ1: U6.AC15(P0.19) ; port IRQ1
IRQ2: J1.38.0 U6.AD8(P0.13) ; port IRQ2
IRQ_DRDY: J1.36.0 U6.AC9(P0.14) ; port IRQ_DRDY
IRQ_MAG: U6.AD12(P0.17) ; port IRQ_MAG
LEDA: J1.4.0 U6.U24(P1.04)
LEDB: J1.5.0 U6.T23(P1.05)
LEDC: J1.6.0 U6.R24(P1.06)
LEDD: J1.7.0 U6.P23(P1.07)
MAG_CS: J1.29.0 U6.R1(P1.09) ; port MAG_CS
NFC1: J1.8.0 U6.L24(P0.09/NFC1)
NFC2: J1.9.0 U6.J24(P0.10/NFC2)
P0.02: J1.13.0 U6.A12(P0.02/AIN0)
P0.03: J1.12.0 U6.B13(P0.03/AIN1)
P0.04: J1.21.0 U6.J1(P0.04/AIN2)
P0.05: J1.22.0 U6.K2(P0.05/AIN3)
P0.06: J1.25.0 U6.L1(P0.06)
P0.07: J1.26.0 U6.M2(P0.07)
P0.12: J1.35.0 U6.U1(P0.12)
P0.15: J1.40.0 U6.AD10(P0.15)
P0.18: J1.37.0 U6.AC13(P0.18/RESET)
P0.24: J1.42.0 U6.AD20(P0.24)
P0.26: J1.19.0 U6.G1(P0.26)
P0.27: J1.20.0 U6.H2(P0.27)
P0.30: J1.17.0 U6.B9(P0.30/AIN6)
P0.31: J1.18.0 U6.A8(P0.31/AIN7)
P1.11: J1.10.0 U6.B19(P1.11)
P1.12: J1.11.0 U6.B17(P1.12)
SWDCLK: J1.3.0 U6.AA24(SWDCLK)
SWDIO: J1.2.0 U6.AC24(SWDIO)
XC1: C75.2 U6.B24(XC1) X1.3
XC2: C74.2 U6.A23(XC2) X1.1
NetC68_2: C68.2 U6.D2(P0.00/XL1) X2.2
NetC69_2: C69.2 U6.F2(P0.01/XL2) X2.1
NetC86_2: C86.2 U6.A18(DEC2)
NetL11_1: L11.1 L12.2

Not connected (* = marked no-connect by the designer): U6 AB2(DCCH)

### Layout directives
net class BGA: DCC, DEC4_6, GND, P0.30, P0.31

### Notes on the sheet
- Core MCU
- (near C77) NF
- DESIGN NOTE:
  Use for antenna matching.
- Title:
- Size:
- Date:
- Function:
- A3
- Number:
- Time:
- Revision:
- Sheet
- of
- DecaWave Ltd.
- Adelaide Chambers,
- Peter Street,
- Dublin 8,
- Ireland.
- This document is Decawave's property, it may not be used, transmitted or reproduced without their approval.
- (in symbol AT3216-B2R7HAAT) 2.4GHz
- (in symbol nRF52840_QIAA) nRF52840

### Library data of the parts
A2 = AT3216-B2R7HAAT: CHIP, 2.45GHZ, 50 OHM, 3.2x1.6 ACX - AAT3216-B2R7HAAT- ANTENNA; Manufacturer Part Number: AMCA31-2R450G-S1F-T; Manufacturer: ACX
C67 C73 C87 C97 = GRM033C81E104ME14D: as C100 on sheet NODE_Misc_V2
C68 C69 C72 C74 C75 C80 C90 C99 C107 = GRM0335C1E120JA01D: 12pF_0201_1%; Manufacturer: Murata Electronics North America; Manufacturer Part Number: GRM0335C1E120JA01D
C70 = GRM155R61A105KE15D: as C65 on sheet NODE_Misc_V2; Manufacturer Part Number: GRM155R61A105KE15D
C71 = GRM188R60J106ME84D: CAP CER 10UF 6.3V X5R 0603; Manufacturer: Murata Electronics North America; Manufacturer Part Number: GRM188R60J106ME47D
C76 C86 C94 C98 = GRM0335C1E101JA01D: CAP CER 100PF 25V NP0 0201; Manufacturer: Murata Electronics North America; Manufacturer Part Number: GRM0335C1E101JA01D
C77 C78 = GRM0335C1H1R0BA01D: CAP CER 1PF 50V NP0 0201; Manufacturer: Murata Electronics North America; Manufacturer Part Number: GRM0335C1H1R0BA01D
C91 C95 C96 = GRM188R60J106ME84D: CAP CER 4.7UF 6.3V X5R 0603; Manufacturer: SamSung; Manufacturer Part Number: CL10A475KQ8NNN#
D2 = DF2S6.2CT,L3F: TVS DIODE 5VWM; Manufacturer: Toshiba Semiconductor and Storage; Manufacturer Part Number: DF2S6.2CT,L3F
F1 F2 = FID1: Fiducial 1mm
J1.1-J1.42 J1.47 J1.52 = EDGE_PIN: PCB Edge pin
L9 = LQP03TG3N3C02D: FIXED IND 3.3NH 400MA 320 MOHM; Manufacturer: Murata Electronics North America; Manufacturer Part Number: LQP03TG3N3C02D
L11 = HK100515NJ-T: FIXED IND 15NH 320MA 460 MOHM; Manufacturer: Taiyo Yuden; Manufacturer Part Number: HK100515NJ-T
L12 = LBMF1608T100K: FIXED IND 10UH 80MA 360 MOHM SMD; Manufacturer: Taiyo Yuden; Manufacturer Part Number: LBMF1608T100K
R7 R10 R11 = RC0201JR-070RL: as R12 on sheet NODE_Misc_V2; Manufacturer Part Number: RC0201JR-070RL
R8 = RC0201JR-070RL: RES SMD 0.0OHM JUMPER 1/20W 0402; Manufacturer: Yageo; Manufacturer Part Number: RC0402JR-070RL
TP15-TP18 = TP: test point
U6 = nRF52840_QIAA: Multi-protocol Bluetooth Low Energy, IEEE 802.15.4, ANT and 2.4GHz proprietary system-on-chip; Manufacturer: Nordic Semiconductor ASA; Note: *; Manufacturer Part Number: nRF52840-QIAA
X1 = ABM10: CRYSTAL 32MHZ 8PF SMD; Manufacturer: Commutek; Manufacturer Part Number: 2CAS
X2 = ABS06-32.768KHZ-T: CRYSTAL 32.7680KHZ 12.5PF SMD; Manufacturer: Commutek; Manufacturer Part Number: KCBB

## Sheet NODE_DW1000_A_V2.SchDoc: PDOA Kit Node
size A3; Date: 07/12/16; Organization: Decawave Ltd.; Address1: Adelaide Chambers,; Address2: Peter Street,; Address3: Dublin 8,; Address4: Ireland.; DocumentNumber: 3; Revision: 2v2; SheetNumber: 3; SheetTotal: 5; SheetFunction: DW1002 A; ProjectName: PDOA Kit Node
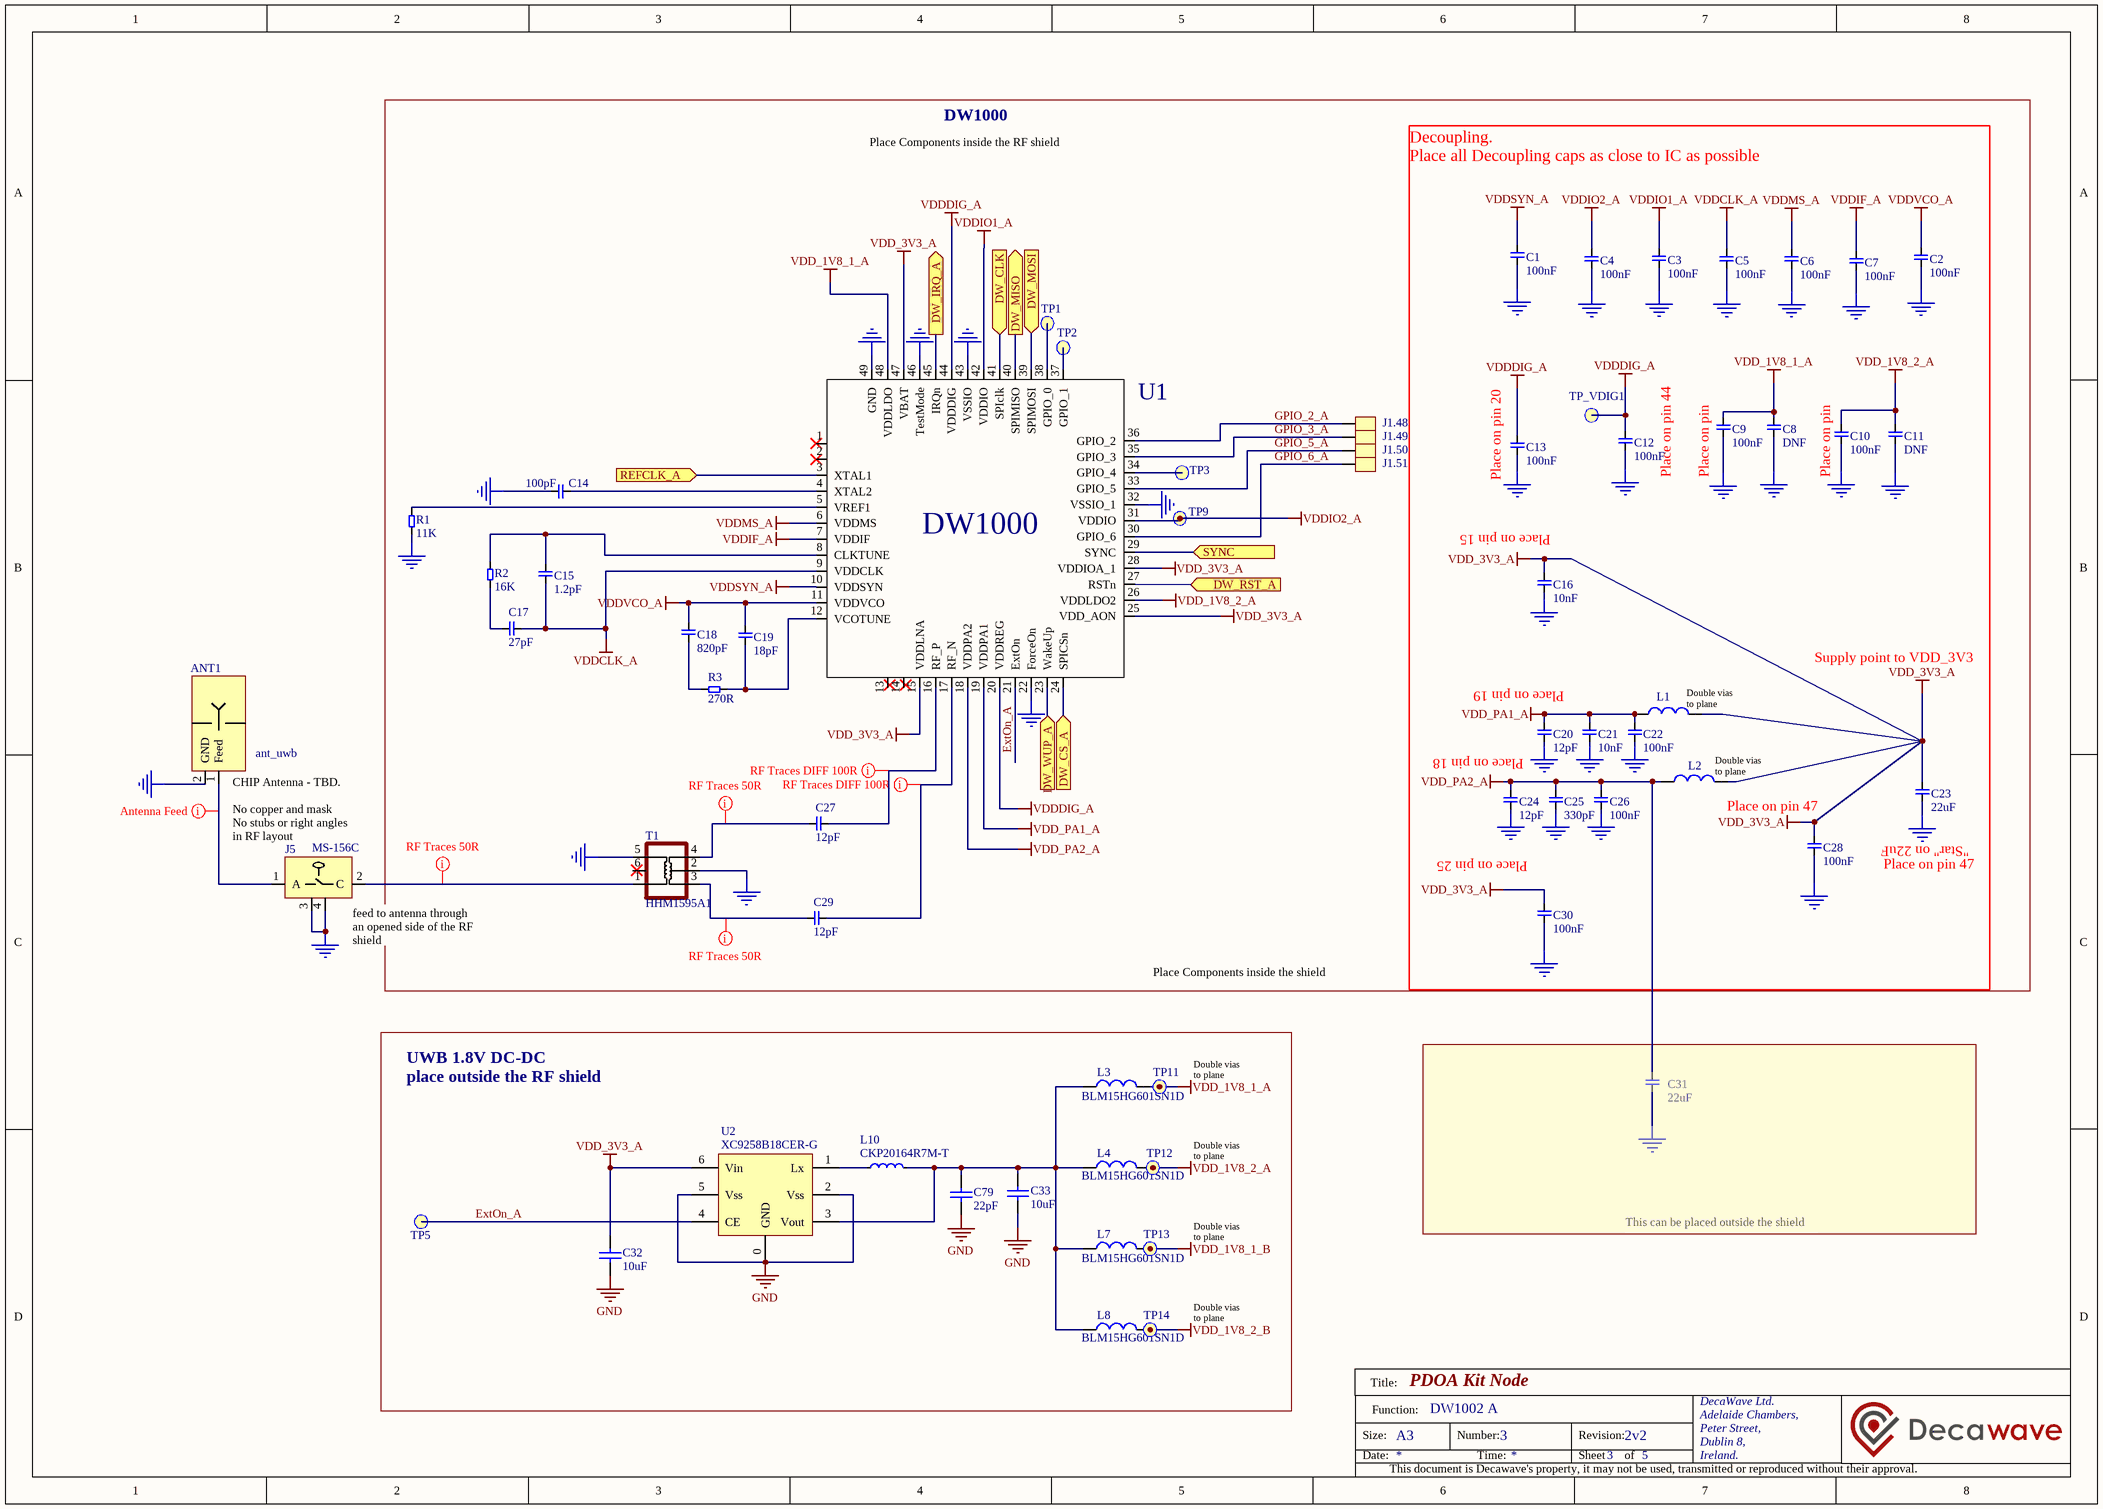
[diagram p3: NODE_DW1000_A_V2.SchDoc]

### Parts
ANT1  ant_uwb  [ANT]
C1  100nF  [C0201-C]
C2  100nF  [C0201-C]
C3  100nF  [C0201-C]
C4  100nF  [C0201-C]
C5  100nF  [C0201-C]
C6  100nF  [C0201-C]
C7  100nF  [C0201-C]
C8  DNF  [C0402]
C9  100nF  [C0201-C]
C10  100nF  [C0201-C]
C11  DNF  [C0402]
C12  100nF  [C0201-C]
C13  100nF  [C0201-C]
C14  100pF  [C0402]
C15  1.2pF  [C0201-C]
C16  10nF  [C0201-C]
C17  27pF  [C0201-C]
C18  820pF  [C0402]
C19  18pF  [C0201-C]
C20  12pF  [C0201-C]
C21  10nF  [C0201-C]
C22  100nF  [C0201-C]
C23  22uF  [C0603]
C24  12pF  [C0201-C]
C25  330pF  [C0201-C]
C26  100nF  [C0201-C]
C27  12pF  [C0201-C]
C28  100nF  [C0201-C]
C29  12pF  [C0201-C]
C30  100nF  [C0201-C]
C31  22uF  [C0603]
C32  10uF  [C0603]
C33  10uF  [C0603]
C79  22pF  [C0201]
J1.48  EDGE_PIN  [PCB_EDGE_1MM]  (value not drawn)
J1.49  EDGE_PIN  [PCB_EDGE_1MM]  (value not drawn)
J1.50  EDGE_PIN  [PCB_EDGE_1MM]  (value not drawn)
J1.51  EDGE_PIN  [PCB_EDGE_1MM]  (value not drawn)
J5  Manufacturer Part Number: MS-156C  [RF_SWITCH_2P3X2P3]  (hidden comment: coswitch)
L1  BLM15HG601SN1D  [L0402]  (value not drawn)
L2  BLM15HG601SN1D  [L0402]  (value not drawn)
L3  BLM15HG601SN1D  [L0402]
L4  BLM15HG601SN1D  [L0402]
L7  BLM15HG601SN1D  [L0402]
L8  BLM15HG601SN1D  [L0402]
L10  CKP20164R7M-T  [INDC2016X10N]
R1  11K  [R0201-C]
R2  16K  [R0201-C]
R3  270R  [R0201-C]
T1  HHM1595A1  [TRANS4_0P65_2P15X1P4]
TP1  TP  [TP_40S]  (value not drawn)
TP2  TP  [TP_40S]  (value not drawn)
TP3  TP  [TP_40S]  (value not drawn)
TP5  TP  [TP_40S]  (value not drawn)
TP9  TP  [TP_40S]  (value not drawn)
TP11  TP  [TP_40S]  (value not drawn)
TP12  TP  [TP_40S]  (value not drawn)
TP13  TP  [TP_40S]  (value not drawn)
TP14  TP  [TP_40S]  (value not drawn)
TP_VDIG1  TP  [TP_40S]  (value not drawn)
U1  DW1000 IC  [QFN48_0P4_6P0X6P0_T]  (value not drawn)
U2  XC9258B18CER-G  [USP-6C]

### Blocks framed on the sheet
DW1000: C1-C30 J1.48-J1.51 L1 L2 R1-R3 T1 TP1-TP3 TP9 TP_VDIG1 U1

### Ports
DW_CLK (in), DW_CS_A (in), DW_IRQ_A (out), DW_MISO (out), DW_MOSI (in), DW_RST_A (in), DW_WUP_A (in), REFCLK_A (in), SYNC (in)

### Nets
GND: ANT1.2(GND) C1.1 C2.1 C3.1 C4.1 C5.1 C6.1 C7.1 C8.1 C9.1 C10.1 C11.1 C12.1 C13.1 C14.2 C16.1 C20.1 C21.1 C22.1 C23.1 C24.1 C25.1 C26.1 C28.1 C30.1 C31.1 C32.1 C33.1 C79.1 J5.3(GND) J5.4(GND) R1.1 T1.2 T1.5 U1.22(ForceOn) U1.32(VSSIO_1) U1.43(VSSIO) U1.46(TestMode) U1.49(GND) U2.0(GND) U2.2(Vss) U2.5(Vss)
VDD_1V8_1_A: C8.2 C9.2 L3.2 TP11.1 U1.48(VDDLDO)
VDD_1V8_1_B: L7.2 TP13.1
VDD_1V8_2_A: C10.2 C11.2 L4.2 TP12.1 U1.26(VDDLDO2)
VDD_1V8_2_B: L8.2 TP14.1
VDD_3V3_A: C16.2 C23.2 C28.2 C30.2 C32.2 L1.2 L2.2 U1.15(VDDLNA) U1.25(VDD_AON) U1.28(VDDIOA_1) U1.47(VBAT) U2.6(Vin)
VDD_PA1_A: C20.2 C21.2 C22.2 L1.1 U1.19(VDDPA1)
VDD_PA2_A: C24.2 C25.2 C26.2 C31.2 L2.1 U1.18(VDDPA2)
VDDCLK_A: C5.2 C15.1 C17.1 U1.9(VDDCLK)
VDDDIG_A: C12.2 C13.2 TP_VDIG1.1 U1.20(VDDREG) U1.44(VDDDIG)
VDDIF_A: C7.2 U1.7(VDDIF)
VDDIO1_A: C3.2 U1.42(VDDIO)
VDDIO2_A: C4.2 TP9.1 U1.31(VDDIO)
VDDMS_A: C6.2 U1.6(VDDMS)
VDDSYN_A: C1.2 U1.10(VDDSYN)
VDDVCO_A: C2.2 C18.2 C19.1 U1.11(VDDVCO)
DW_CLK: U1.41(SPIclk) ; port DW_CLK
DW_CS_A: U1.24(SPICSn) ; port DW_CS_A
DW_IRQ_A: U1.45(IRQn) ; port DW_IRQ_A
DW_MISO: U1.40(SPIMISO) ; port DW_MISO
DW_MOSI: U1.39(SPIMOSI) ; port DW_MOSI
DW_RST_A: U1.27(RSTn) ; port DW_RST_A
DW_WUP_A: U1.23(WakeUp) ; port DW_WUP_A
ExtOn_A: TP5.1 U1.21(ExtOn) U2.4(CE)
GPIO_2_A: J1.48.0 U1.36(GPIO_2)
GPIO_3_A: J1.49.0 U1.35(GPIO_3)
GPIO_5_A: J1.50.0 U1.33(GPIO_5)
GPIO_6_A: J1.51.0 U1.30(GPIO_6)
REFCLK_A: U1.3(XTAL1) ; port REFCLK_A
SYNC: U1.29(SYNC) ; port SYNC
NetANT1_1: ANT1.1(Feed) J5.1(A)
NetC14_1: C14.1 U1.4(XTAL2)
NetC15_2: C15.2 R2.2 U1.8(CLKTUNE)
NetC17_2: C17.2 R2.1
NetC18_1: C18.1 R3.2
NetC19_2: C19.2 R3.1 U1.12(VCOTUNE)
NetC27_1: C27.1 T1.4
NetC27_2: C27.2 U1.16(RF_P)
NetC29_1: C29.1 T1.3
NetC29_2: C29.2 U1.17(RF_N)
NetC33_2: C33.2 C79.2 L3.1 L4.1 L7.1 L8.1 L10.2 U2.3(Vout)
NetJ5_2: J5.2(C) T1.1
NetL10_1: L10.1 U2.1(Lx)
NetR1_2: R1.2 U1.5(VREF1)
NetTP1_1: TP1.1 U1.38(GPIO_0)
NetTP2_1: TP2.1 U1.37(GPIO_1)
NetTP3_1: TP3.1 U1.34(GPIO_4)

Not connected (* = marked no-connect by the designer): T1 6; U1 1* 2* 13 14

### Layout directives
net class RF Traces 50R: NetC27_1, NetC27_2, NetC29_1, NetC29_2, NetJ5_2
net class Antenna Feed: NetANT1_1

### Notes on the sheet
- Place Components inside the RF shield
- (near C13) Place on pin 20
- Place on pin 44
- (near C9) Place on pin
- (near C10) Place on pin
- (near C16) Place on pin 15
- Place on pin 19
- (near L1) Double vias
  to plane
- Supply point to VDD_3V3
- Place on pin 18
- (near L2) Double vias
  to plane
- (near ANT1) CHIP Antenna - TBD.
  No copper and mask
  No stubs or right angles in RF layout
- Place on pin 25
- Place on pin 47
- "Star" on 22uF
- (near J5) feed to antenna through an opened side of the RF shield
- Place Components inside the shield
- Decoupling.
  Place all Decoupling caps as close to IC as possible
- UWB 1.8V DC-DC
  place outside the RF shield
- (near TP11) Double vias
  to plane
- Double vias
  to plane
- This can be placed outside the shield
- Title:
- Size:
- Date:
- Function:
- A3
- Number:
- Time:
- Revision:
- Sheet
- of
- DecaWave Ltd.
- Adelaide Chambers,
- Peter Street,
- Dublin 8,
- Ireland.
- This document is Decawave's property, it may not be used, transmitted or reproduced without their approval.

### Library data of the parts
ANT1 = M10044: CHIP ANT
C1-C7 C9 C10 C12 C13 C22 C26 C28 C30 = C10051: as C82 on sheet NODE_Misc_V2
C8 C11 = C10007: 4.7uF_0402_10%; Manufacturer: TDK; Manufacturer Part Number: C1005X5R0J475K050BC
C14 = C10017: 100pF_0402_10%; Manufacturer Part Number: GRM1555C1H101JA01D; Manufacturer: Murata Electronics North America
C15 = C10056: 1.2pF_0201_10%; Manufacturer: Murata Electronics North America; Manufacturer Part Number: GRM0335C1E1R2CA01D
C16 C21 = C10062: as C84 on sheet NODE_Misc_V2
C17 = C10057: 27pF_0201_2%; Manufacturer: Murata Electronics North America; Manufacturer Part Number: GRM0335C1E270JA01D
C18 = C10054: 820pF_0201_2%; Manufacturer: Murata Electronics North America; Manufacturer Part Number: GRM033R71E821KA01D
C19 = C10053: 18pF_0201_1%; Manufacturer: Murata Electronics North America; Manufacturer Part Number: GRM0335C1H180JA01D
C20 C24 C27 C29 = C10060: 12pF_0201_1%; Manufacturer: Murata Electronics North America; Manufacturer Part Number: GRM0335C1E120JA01D
C23 C31 = C10059: 22uF_0603_10%; Manufacturer: Murata Electronics North America; Manufacturer Part Number: GRM188R60J226MEA0D
C25 = C10061: 330pF_0201_10%; Manufacturer: SamSung; Manufacturer Part Number: CL03B331KA3NNNC
C32 C33 = GRM188R60J106ME84D: as C71 on sheet NODE_MCU_V2
C79 = GRM0335C1E100JA01D: CAP CER 10PF 25V NP0 0201; Manufacturer: Murata Electronics North America; Manufacturer Part Number: GRM0335C1E220JA01D; Failure Rate: *
J1.48-J1.51 = EDGE_PIN: PCB Edge pin
J5 = J10015: COAX JACK STR 50 OHM SMD; Manufacturer: Hirose
L1-L4 L7 L8 = M10012: as L13 on sheet NODE_Misc_V2; Manufacturer Part Number: BLM15HG601SN1D
L10 = CKP20162R2M-T: FIXED IND 2.2UH 1.2A 110 MOHM; Manufacturer: Taiyo Yuden; Manufacturer Part Number: CKP20162R2M-T
R1 = R10051: as R36 on sheet NODE_Misc_V2
R2 = R10054: 16K_0201_1%; Manufacturer: Yageo; Manufacturer Part Number: RC0201FR-0716KL
R3 = R10050: 270R_0201_1%; Manufacturer: Yageo; Manufacturer Part Number: RC0201FR-07270RL
T1 = M10043: SMT UWB Balun 3-8Ghz; Manufacturer: TDK; Manufacturer Part Number: HHM1595A1
TP1-TP3 TP5 TP9 TP11-TP14 TP_VDIG1 = TP: test point
U1 = U10000: UMB Transceiver; Manufacturer: Decawave; Manufacturer Part Number: DW1000
U2 = XC9257/8: Manufacturer: Torex; Manufacturer Part Number: XC9258B18CER-G

## Sheet NODE_DW1000_B_V2.SchDoc: PDOA Kit Node
size A3; Organization: Decawave Ltd.; Address1: Adelaide Chambers,; Address2: Peter Street,; Address3: Dublin 8,; Address4: Ireland.; DocumentNumber: 4; Revision: 2v2; SheetNumber: 4; SheetTotal: 5; SheetFunction: DW1000 B; ProjectName: PDOA Kit Node
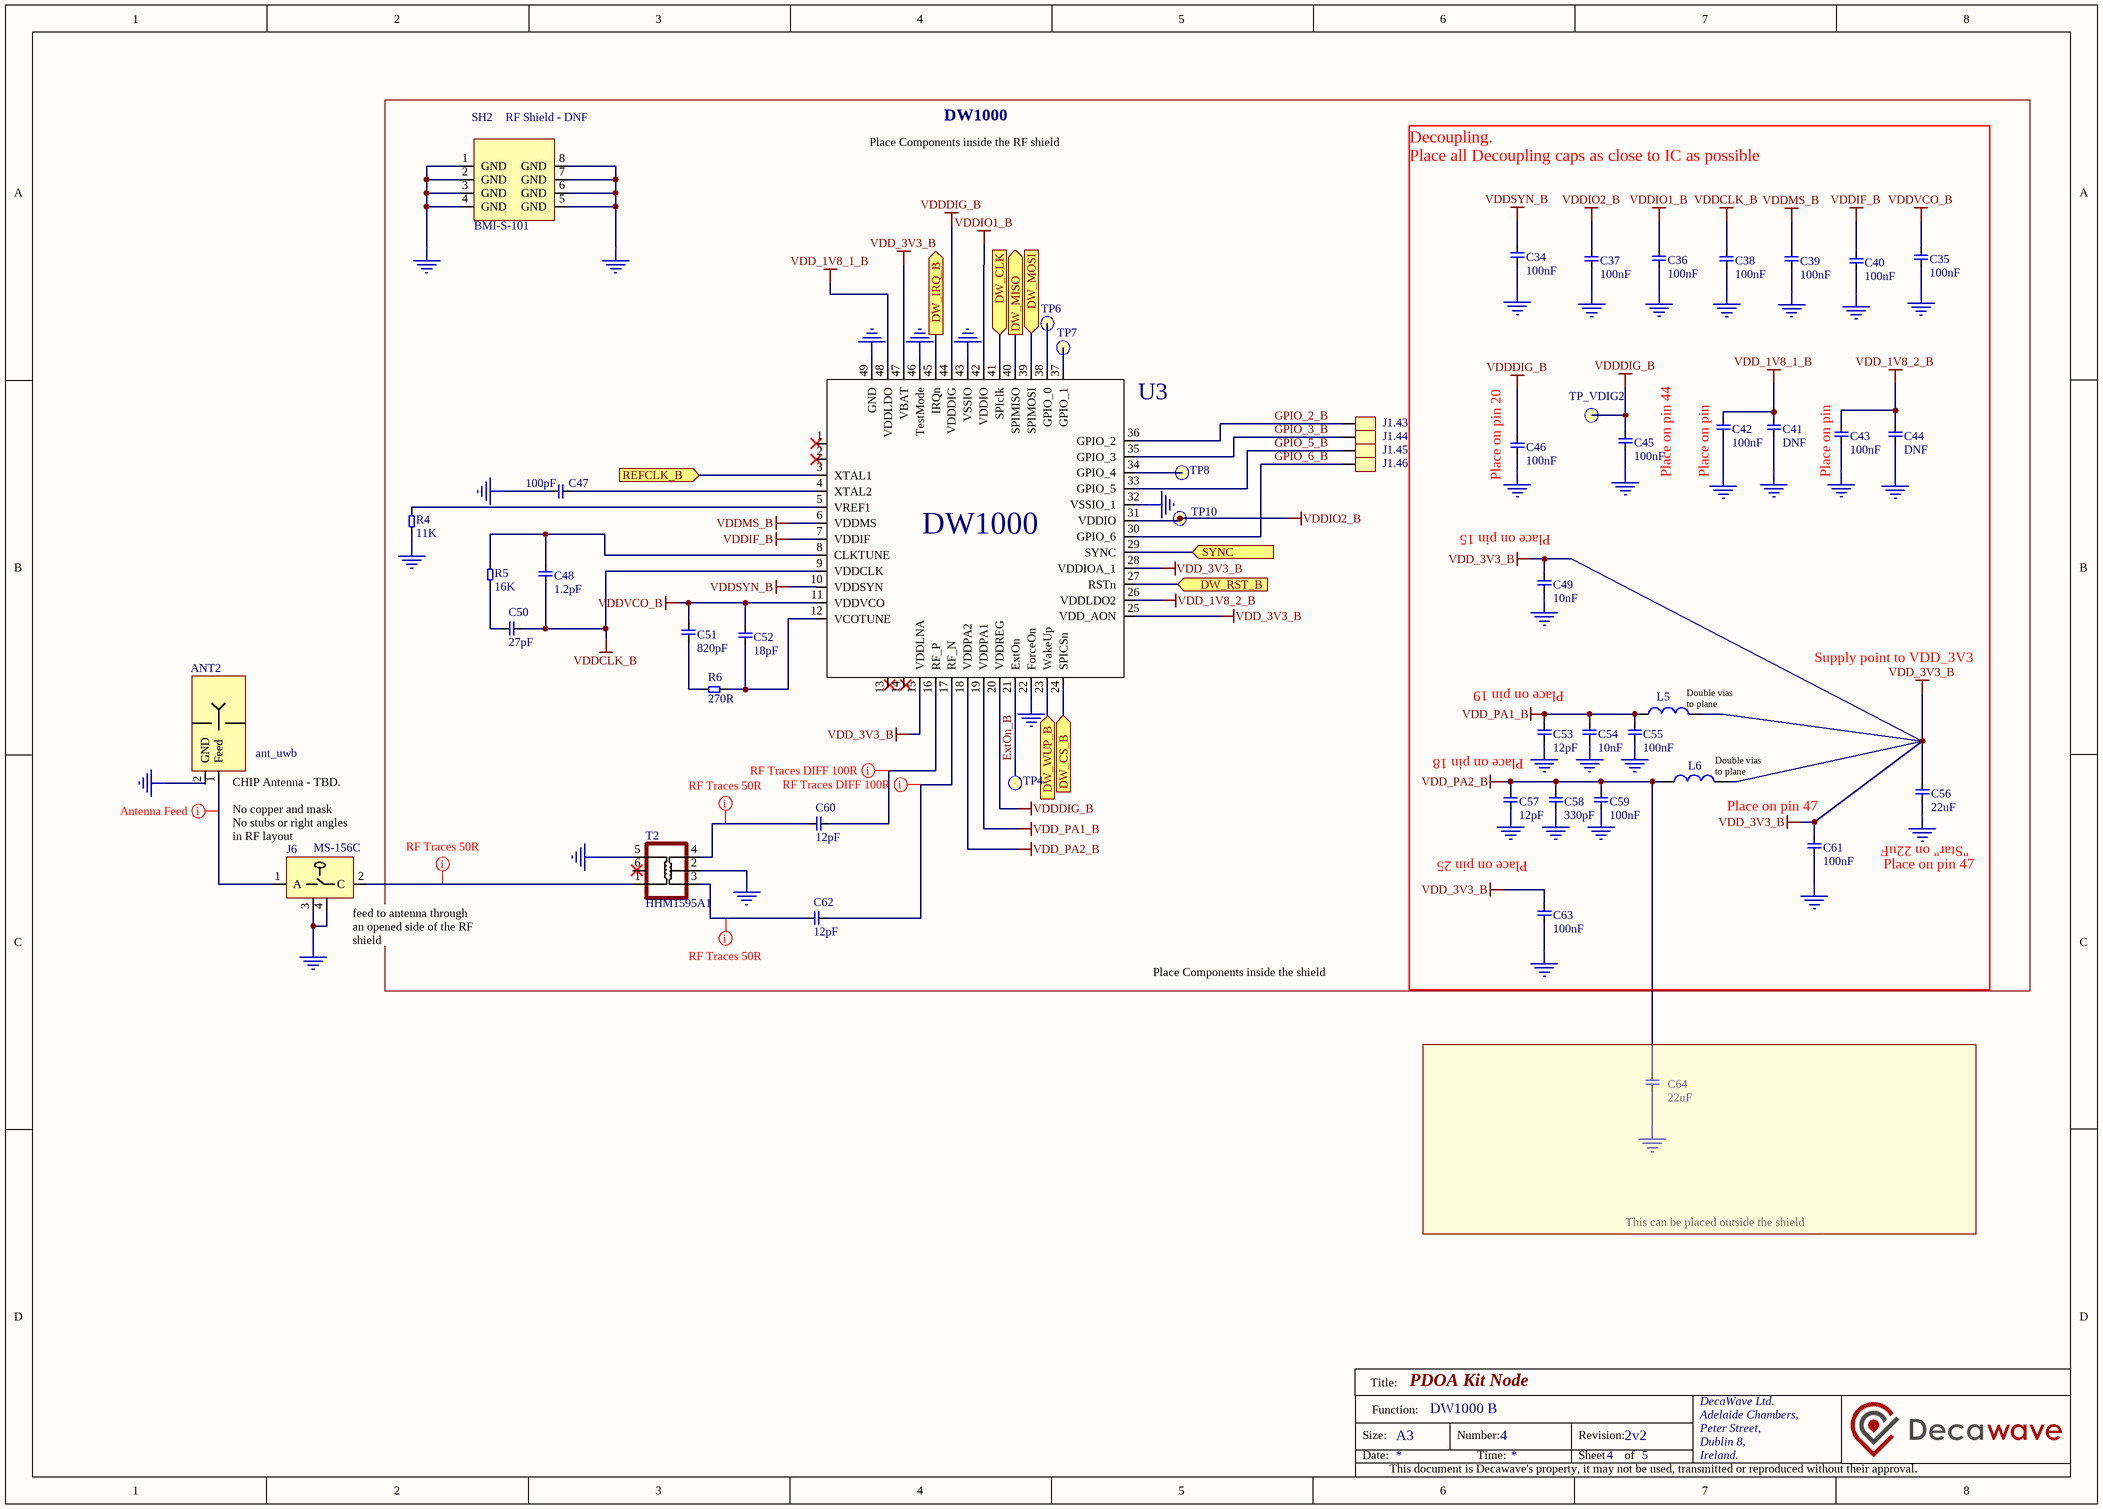
[diagram p4: NODE_DW1000_B_V2.SchDoc]

### Parts
ANT2  ant_uwb  [ANT]
C34  100nF  [C0201-C]
C35  100nF  [C0201-C]
C36  100nF  [C0201-C]
C37  100nF  [C0201-C]
C38  100nF  [C0201-C]
C39  100nF  [C0201-C]
C40  100nF  [C0201-C]
C41  DNF  [C0402]
C42  100nF  [C0201-C]
C43  100nF  [C0201-C]
C44  DNF  [C0402]
C45  100nF  [C0201-C]
C46  100nF  [C0201-C]
C47  100pF  [C0402]
C48  1.2pF  [C0201-C]
C49  10nF  [C0201-C]
C50  27pF  [C0201-C]
C51  820pF  [C0402]
C52  18pF  [C0201-C]
C53  12pF  [C0201-C]
C54  10nF  [C0201-C]
C55  100nF  [C0201-C]
C56  22uF  [C0603]
C57  12pF  [C0201-C]
C58  330pF  [C0201-C]
C59  100nF  [C0201-C]
C60  12pF  [C0201-C]
C61  100nF  [C0201-C]
C62  12pF  [C0201-C]
C63  100nF  [C0201-C]
C64  22uF  [C0603]
J1.43  EDGE_PIN  [PCB_EDGE_1MM]  (value not drawn)
J1.44  EDGE_PIN  [PCB_EDGE_1MM]  (value not drawn)
J1.45  EDGE_PIN  [PCB_EDGE_1MM]  (value not drawn)
J1.46  EDGE_PIN  [PCB_EDGE_1MM]  (value not drawn)
J6  Manufacturer Part Number: MS-156C  [RF_SWITCH_2P3X2P3]  (hidden comment: coswitch)
L5  BLM15HG601SN1D  [L0402]  (value not drawn)
L6  BLM15HG601SN1D  [L0402]  (value not drawn)
R4  11K  [R0201-C]
R5  16K  [R0201-C]
R6  270R  [R0201-C]
SH2  BMI-S-101  [RF_SH_12P7X13P66]
T2  HHM1595A1  [TRANS4_0P65_2P15X1P4]
TP4  TP  [TP_40S]  (value not drawn)
TP6  TP  [TP_40S]  (value not drawn)
TP7  TP  [TP_40S]  (value not drawn)
TP8  TP  [TP_40S]  (value not drawn)
TP10  TP  [TP_40S]  (value not drawn)
TP_VDIG2  TP  [TP_40S]  (value not drawn)
U3  DW1000 IC  [QFN48_0P4_6P0X6P0_T]  (value not drawn)

### Blocks framed on the sheet
DW1000: C34-C63 J1.43-J1.46 L5 L6 R4-R6 SH2 T2 TP4 TP6-TP8 TP10 TP_VDIG2 U3

### Ports
DW_CLK (in), DW_CS_B (in), DW_IRQ_B (out), DW_MISO (out), DW_MOSI (in), DW_RST_B (in), DW_WUP_B (in), REFCLK_B (in), SYNC (in)

### Nets
GND: ANT2.2(GND) C34.1 C35.1 C36.1 C37.1 C38.1 C39.1 C40.1 C41.1 C42.1 C43.1 C44.1 C45.1 C46.1 C47.2 C49.1 C53.1 C54.1 C55.1 C56.1 C57.1 C58.1 C59.1 C61.1 C63.1 C64.1 J6.3(GND) J6.4(GND) R4.1 SH2.1(GND) SH2.2(GND) SH2.3(GND) SH2.4(GND) SH2.5(GND) SH2.6(GND) SH2.7(GND) SH2.8(GND) T2.2 T2.5 U3.22(ForceOn) U3.32(VSSIO_1) U3.43(VSSIO) U3.46(TestMode) U3.49(GND)
VDD_1V8_1_B: C41.2 C42.2 U3.48(VDDLDO)
VDD_1V8_2_B: C43.2 C44.2 U3.26(VDDLDO2)
VDD_3V3_B: C49.2 C56.2 C61.2 C63.2 L5.2 L6.2 U3.15(VDDLNA) U3.25(VDD_AON) U3.28(VDDIOA_1) U3.47(VBAT)
VDD_PA1_B: C53.2 C54.2 C55.2 L5.1 U3.19(VDDPA1)
VDD_PA2_B: C57.2 C58.2 C59.2 C64.2 L6.1 U3.18(VDDPA2)
VDDCLK_B: C38.2 C48.1 C50.1 U3.9(VDDCLK)
VDDDIG_B: C45.2 C46.2 TP_VDIG2.1 U3.20(VDDREG) U3.44(VDDDIG)
VDDIF_B: C40.2 U3.7(VDDIF)
VDDIO1_B: C36.2 U3.42(VDDIO)
VDDIO2_B: C37.2 TP10.1 U3.31(VDDIO)
VDDMS_B: C39.2 U3.6(VDDMS)
VDDSYN_B: C34.2 U3.10(VDDSYN)
VDDVCO_B: C35.2 C51.2 C52.1 U3.11(VDDVCO)
DW_CLK: U3.41(SPIclk) ; port DW_CLK
DW_CS_B: U3.24(SPICSn) ; port DW_CS_B
DW_IRQ_B: U3.45(IRQn) ; port DW_IRQ_B
DW_MISO: U3.40(SPIMISO) ; port DW_MISO
DW_MOSI: U3.39(SPIMOSI) ; port DW_MOSI
DW_RST_B: U3.27(RSTn) ; port DW_RST_B
DW_WUP_B: U3.23(WakeUp) ; port DW_WUP_B
ExtOn_B: TP4.1 U3.21(ExtOn)
GPIO_2_B: J1.43.0 U3.36(GPIO_2)
GPIO_3_B: J1.44.0 U3.35(GPIO_3)
GPIO_5_B: J1.45.0 U3.33(GPIO_5)
GPIO_6_B: J1.46.0 U3.30(GPIO_6)
REFCLK_B: U3.3(XTAL1) ; port REFCLK_B
SYNC: U3.29(SYNC) ; port SYNC
NetANT2_1: ANT2.1(Feed) J6.1(A)
NetC47_1: C47.1 U3.4(XTAL2)
NetC48_2: C48.2 R5.2 U3.8(CLKTUNE)
NetC50_2: C50.2 R5.1
NetC51_1: C51.1 R6.2
NetC52_2: C52.2 R6.1 U3.12(VCOTUNE)
NetC60_1: C60.1 T2.4
NetC60_2: C60.2 U3.16(RF_P)
NetC62_1: C62.1 T2.3
NetC62_2: C62.2 U3.17(RF_N)
NetJ6_2: J6.2(C) T2.1
NetR4_2: R4.2 U3.5(VREF1)
NetTP6_1: TP6.1 U3.38(GPIO_0)
NetTP7_1: TP7.1 U3.37(GPIO_1)
NetTP8_1: TP8.1 U3.34(GPIO_4)

Not connected (* = marked no-connect by the designer): T2 6; U3 1* 2* 13 14

### Layout directives
net class RF Traces 50R: NetC60_1, NetC60_2, NetC62_1, NetC62_2, NetJ6_2
net class Antenna Feed: NetANT2_1

### Notes on the sheet
- (near SH2) RF Shield - DNF
- Place Components inside the RF shield
- (near C46) Place on pin 20
- Place on pin 44
- (near C42) Place on pin
- (near C43) Place on pin
- (near C49) Place on pin 15
- Place on pin 19
- (near L5) Double vias
  to plane
- Supply point to VDD_3V3
- Place on pin 18
- (near L6) Double vias
  to plane
- (near ANT2) CHIP Antenna - TBD.
  No copper and mask
  No stubs or right angles in RF layout
- Place on pin 25
- Place on pin 47
- "Star" on 22uF
- (near J6) feed to antenna through an opened side of the RF shield
- Place Components inside the shield
- Decoupling.
  Place all Decoupling caps as close to IC as possible
- This can be placed outside the shield
- Title:
- Size:
- Date:
- Function:
- A3
- Number:
- Time:
- Revision:
- Sheet
- of
- DecaWave Ltd.
- Adelaide Chambers,
- Peter Street,
- Dublin 8,
- Ireland.
- This document is Decawave's property, it may not be used, transmitted or reproduced without their approval.

### Library data of the parts
ANT2 = M10044: CHIP ANT
C34-C40 C42 C43 C45 C46 C55 C59 C61 C63 = C10051: as C82 on sheet NODE_Misc_V2
C41 C44 = C10007: as C8 on sheet NODE_DW1000_A_V2
C47 = C10017: as C14 on sheet NODE_DW1000_A_V2
C48 = C10056: as C15 on sheet NODE_DW1000_A_V2
C49 C54 = C10062: as C84 on sheet NODE_Misc_V2
C50 = C10057: as C17 on sheet NODE_DW1000_A_V2
C51 = C10054: as C18 on sheet NODE_DW1000_A_V2
C52 = C10053: as C19 on sheet NODE_DW1000_A_V2
C53 C57 C60 C62 = C10060: as C20 on sheet NODE_DW1000_A_V2
C56 C64 = C10059: as C23 on sheet NODE_DW1000_A_V2
C58 = C10061: as C25 on sheet NODE_DW1000_A_V2
J1.43-J1.46 = EDGE_PIN: PCB Edge pin
J6 = J10015: as J5 on sheet NODE_DW1000_A_V2
L5 L6 = M10012: as L13 on sheet NODE_Misc_V2; Manufacturer Part Number: BLM15HG601SN1D
R4 = R10051: as R36 on sheet NODE_Misc_V2
R5 = R10054: as R2 on sheet NODE_DW1000_A_V2
R6 = R10050: as R3 on sheet NODE_DW1000_A_V2
SH2 = M10011: RF Shield 13.66x12.1mm; Manufacturer: Laird; Manufacturer Part Number: BMI-S-101
T2 = M10043: SMT UWB Balun 3-8Ghz; Manufacturer: TDK; Manufacturer Part Number: HHM1595A1
TP4 TP6-TP8 TP10 TP_VDIG2 = TP: test point
U3 = U10000: UMB Transceiver; Manufacturer: Decawave; Manufacturer Part Number: DW1000

## Nets that join several sheets
GND: NODE_Misc_V2 (25 pins), NODE_MCU_V2 (37 pins), NODE_DW1000_A_V2 (42 pins), NODE_DW1000_B_V2 (44 pins)
VCC_DEV: NODE_Misc_V2 (13 pins), NODE_MCU_V2 (18 pins)
VDD_1V8_1_B: NODE_DW1000_A_V2 (L7.2 TP13.1), NODE_DW1000_B_V2 (C41.2 C42.2 U3.48)
VDD_1V8_2_B: NODE_DW1000_A_V2 (L8.2 TP14.1), NODE_DW1000_B_V2 (C43.2 C44.2 U3.26)
VDD_3V3_A: NODE_MCU_V2 (R8.2 TP17.1), NODE_DW1000_A_V2 (12 pins)
VDD_3V3_B: NODE_MCU_V2 (R7.2 TP16.1), NODE_DW1000_B_V2 (10 pins)
VDD_TCXO: NODE_Misc_V2 (12 pins), NODE_MCU_V2 (R11.2 TP18.1)
ACC_BAR_SDO: NODE_Misc_V2 (U5.5 U7.1), NODE_MCU_V2 (J1.27.0 U6.N1)
ACC_CS: NODE_Misc_V2 (U7.12), NODE_MCU_V2 (J1.28.0 U6.P2)
BAR_CS: NODE_Misc_V2 (U5.6), NODE_MCU_V2 (J1.34.0 U6.T2)
DW_CLK: NODE_MCU_V2 (U6.AC11), NODE_DW1000_A_V2 (U1.41), NODE_DW1000_B_V2 (U3.41)
DW_CS_A: NODE_MCU_V2 (U6.AC21), NODE_DW1000_A_V2 (U1.24)
DW_CS_B: NODE_MCU_V2 (U6.Y23), NODE_DW1000_B_V2 (U3.24)
DW_IRQ_A: NODE_MCU_V2 (J1.41.0 U6.AC19), NODE_DW1000_A_V2 (U1.45)
DW_IRQ_B: NODE_MCU_V2 (U6.A20), NODE_DW1000_B_V2 (U3.45)
DW_MISO: NODE_MCU_V2 (U6.AC17), NODE_DW1000_A_V2 (U1.40), NODE_DW1000_B_V2 (U3.40)
DW_MOSI: NODE_MCU_V2 (U6.AD16), NODE_DW1000_A_V2 (U1.39), NODE_DW1000_B_V2 (U3.39)
DW_RST_A: NODE_MCU_V2 (U6.AD18), NODE_DW1000_A_V2 (U1.27)
DW_RST_B: NODE_MCU_V2 (U6.W24), NODE_DW1000_B_V2 (U3.27)
DW_SYNC: NODE_Misc_V2 (U11.3), NODE_MCU_V2 (U6.A14)
DW_SYNC_CLR: NODE_Misc_V2 (U11.6), NODE_MCU_V2 (U6.B15)
DW_SYNC_EN: NODE_Misc_V2 (U9.2), NODE_MCU_V2 (U6.A16)
DW_WUP_A: NODE_MCU_V2 (U6.AD22), NODE_DW1000_A_V2 (U1.23)
DW_WUP_B: NODE_MCU_V2 (U6.V23), NODE_DW1000_B_V2 (U3.23)
I2C_SCL: NODE_Misc_V2 (U4.1 U5.2 U7.13), NODE_MCU_V2 (J1.15.0 U6.B11)
I2C_SDA: NODE_Misc_V2 (U4.4 U5.4 U7.14), NODE_MCU_V2 (J1.16.0 U6.A10)
IRQ1: NODE_Misc_V2 (U7.4), NODE_MCU_V2 (U6.AC15)
IRQ2: NODE_Misc_V2 (U7.9), NODE_MCU_V2 (J1.38.0 U6.AD8)
IRQ_DRDY: NODE_Misc_V2 (U5.7), NODE_MCU_V2 (J1.36.0 U6.AC9)
IRQ_MAG: NODE_Misc_V2 (U4.7), NODE_MCU_V2 (U6.AD12)
MAG_CS: NODE_Misc_V2 (U4.3), NODE_MCU_V2 (J1.29.0 U6.R1)
REFCLK_A: NODE_Misc_V2 (C84.1), NODE_DW1000_A_V2 (U1.3)
REFCLK_B: NODE_Misc_V2 (C85.1), NODE_DW1000_B_V2 (U3.3)
SYNC: NODE_Misc_V2 (U11.4), NODE_DW1000_A_V2 (U1.29), NODE_DW1000_B_V2 (U3.29)